# EasyEDA schematic stm32开发板f103.json

## Sheets
1 一些外设: TITLE: 一些外设; REV: 1.0; Date: 2022-10-25; Sheet: 2/7; Drawn By: Uchiha-Leslie; Company: Your Company
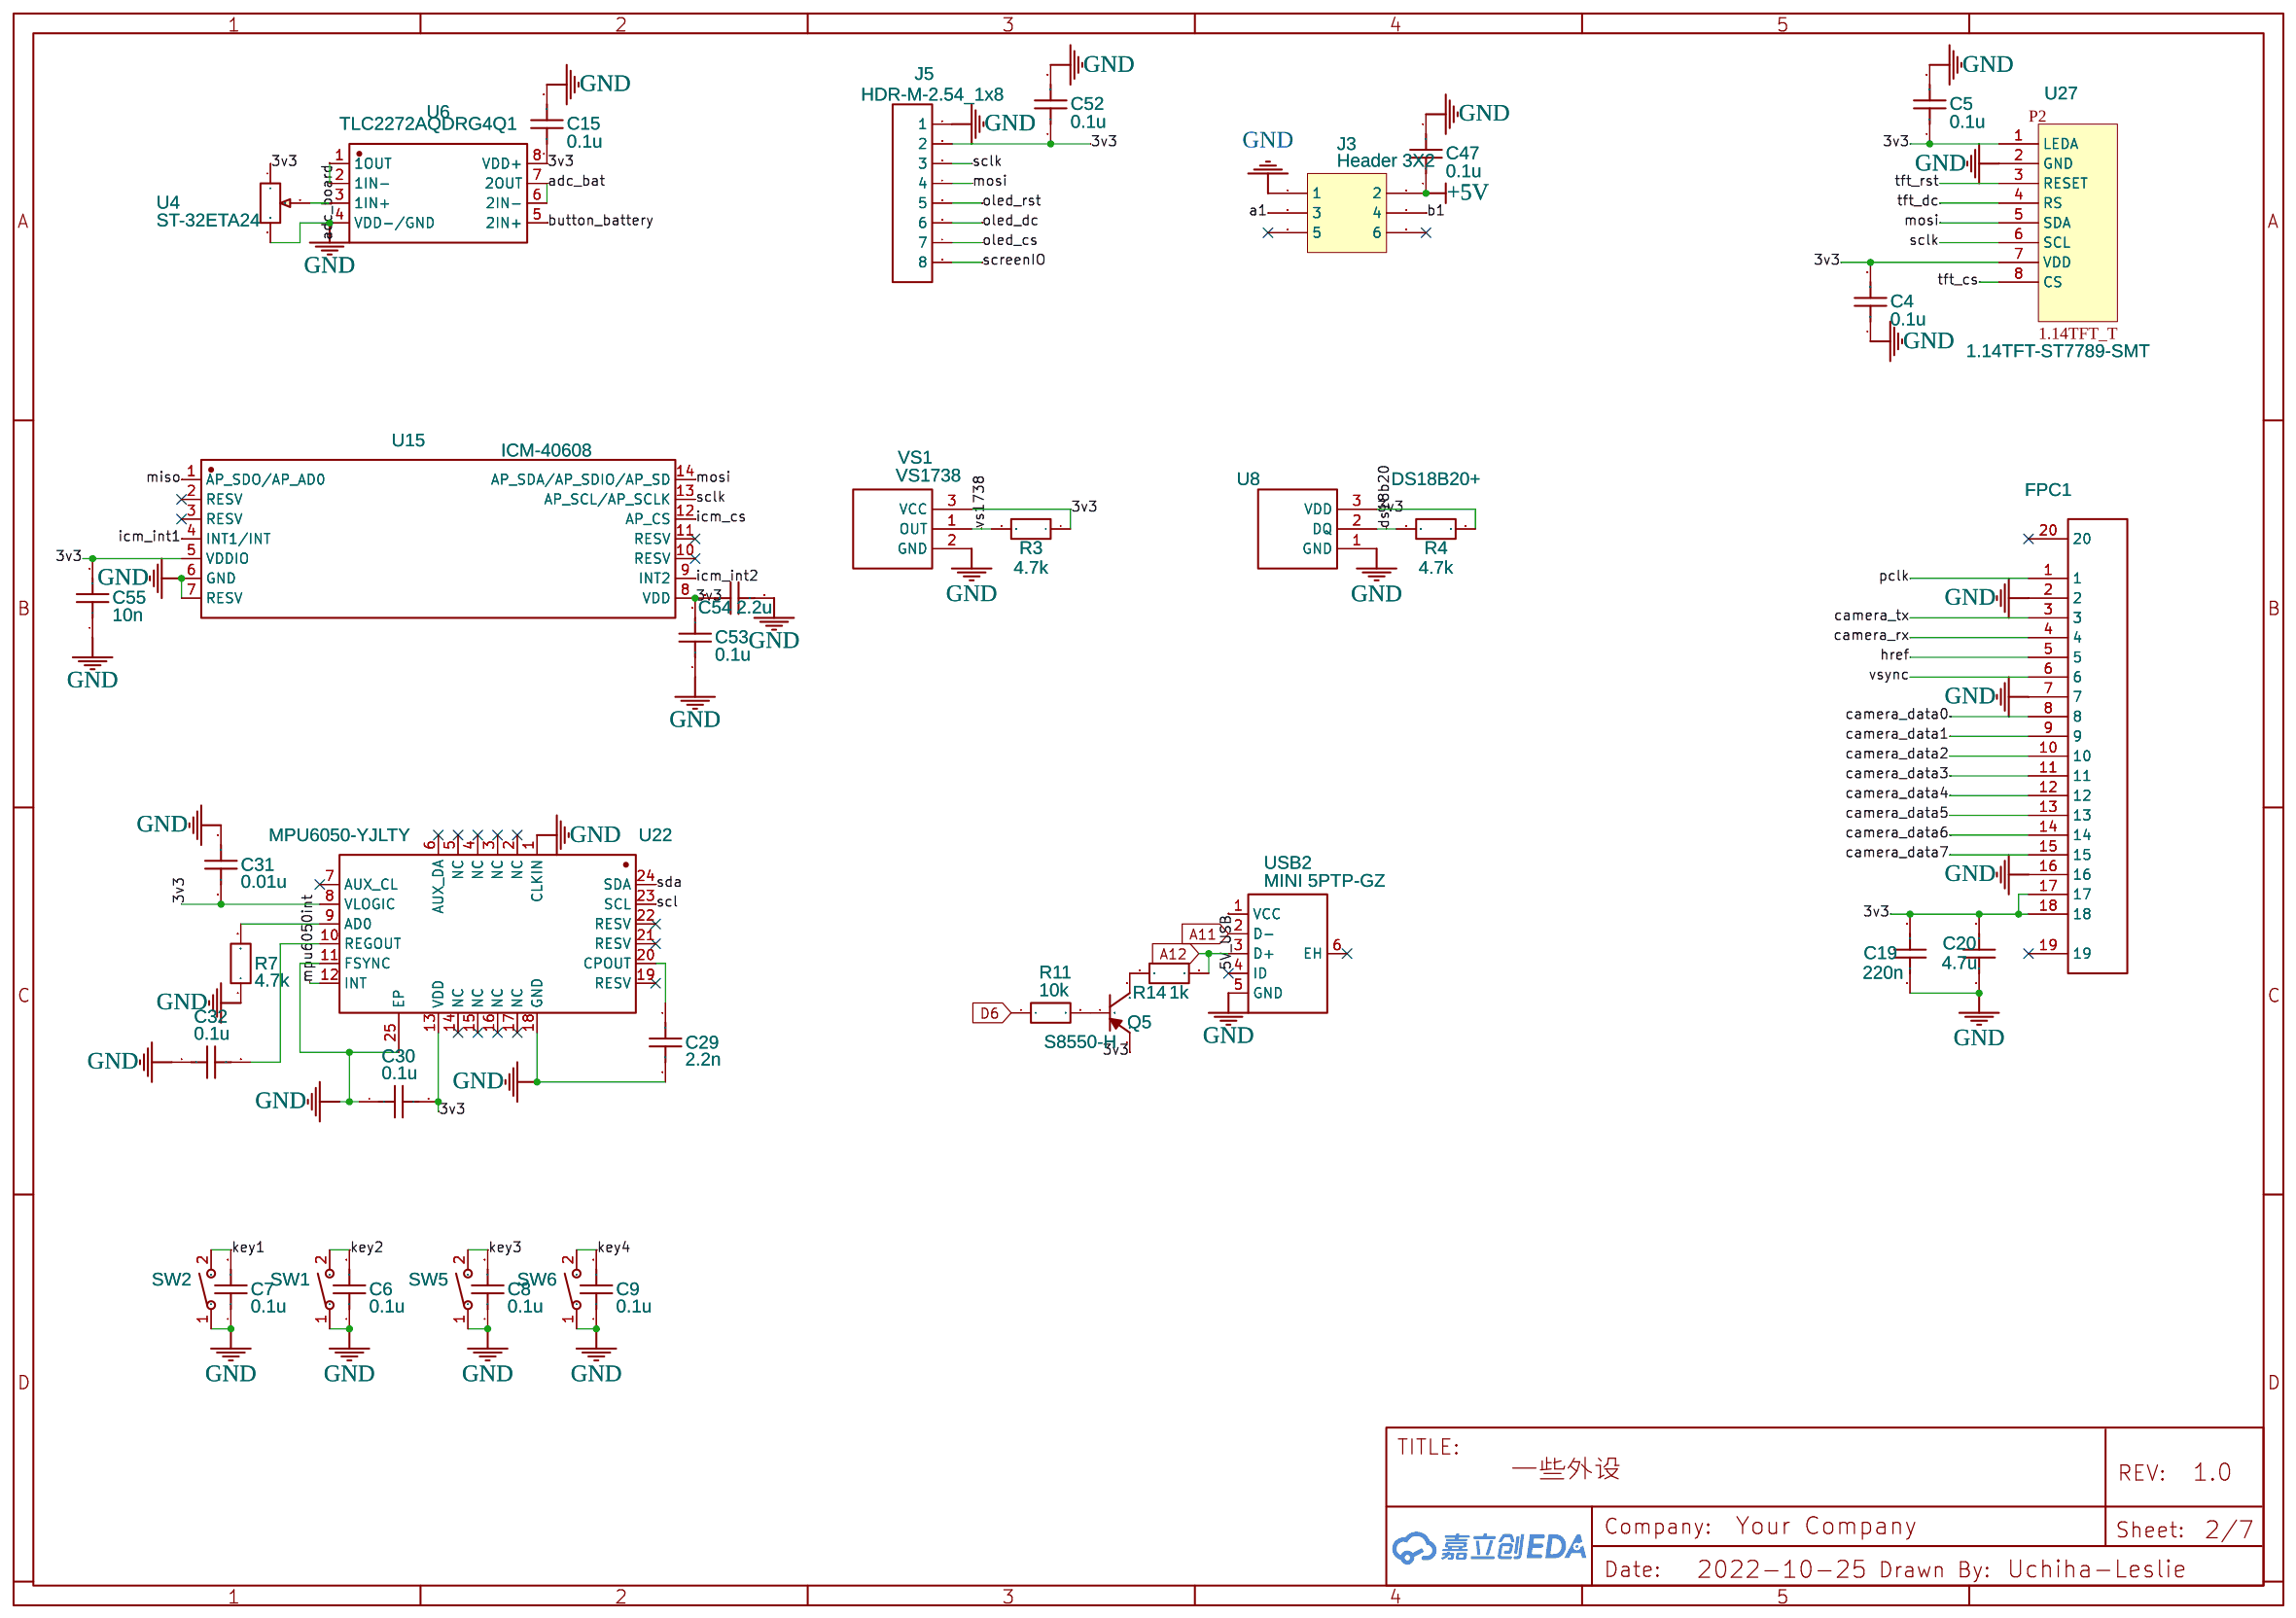
[diagram p0: 一些外设]
2 电源及串口: TITLE: 电源、串口; Date: 2022-10-26; Sheet: 3/7
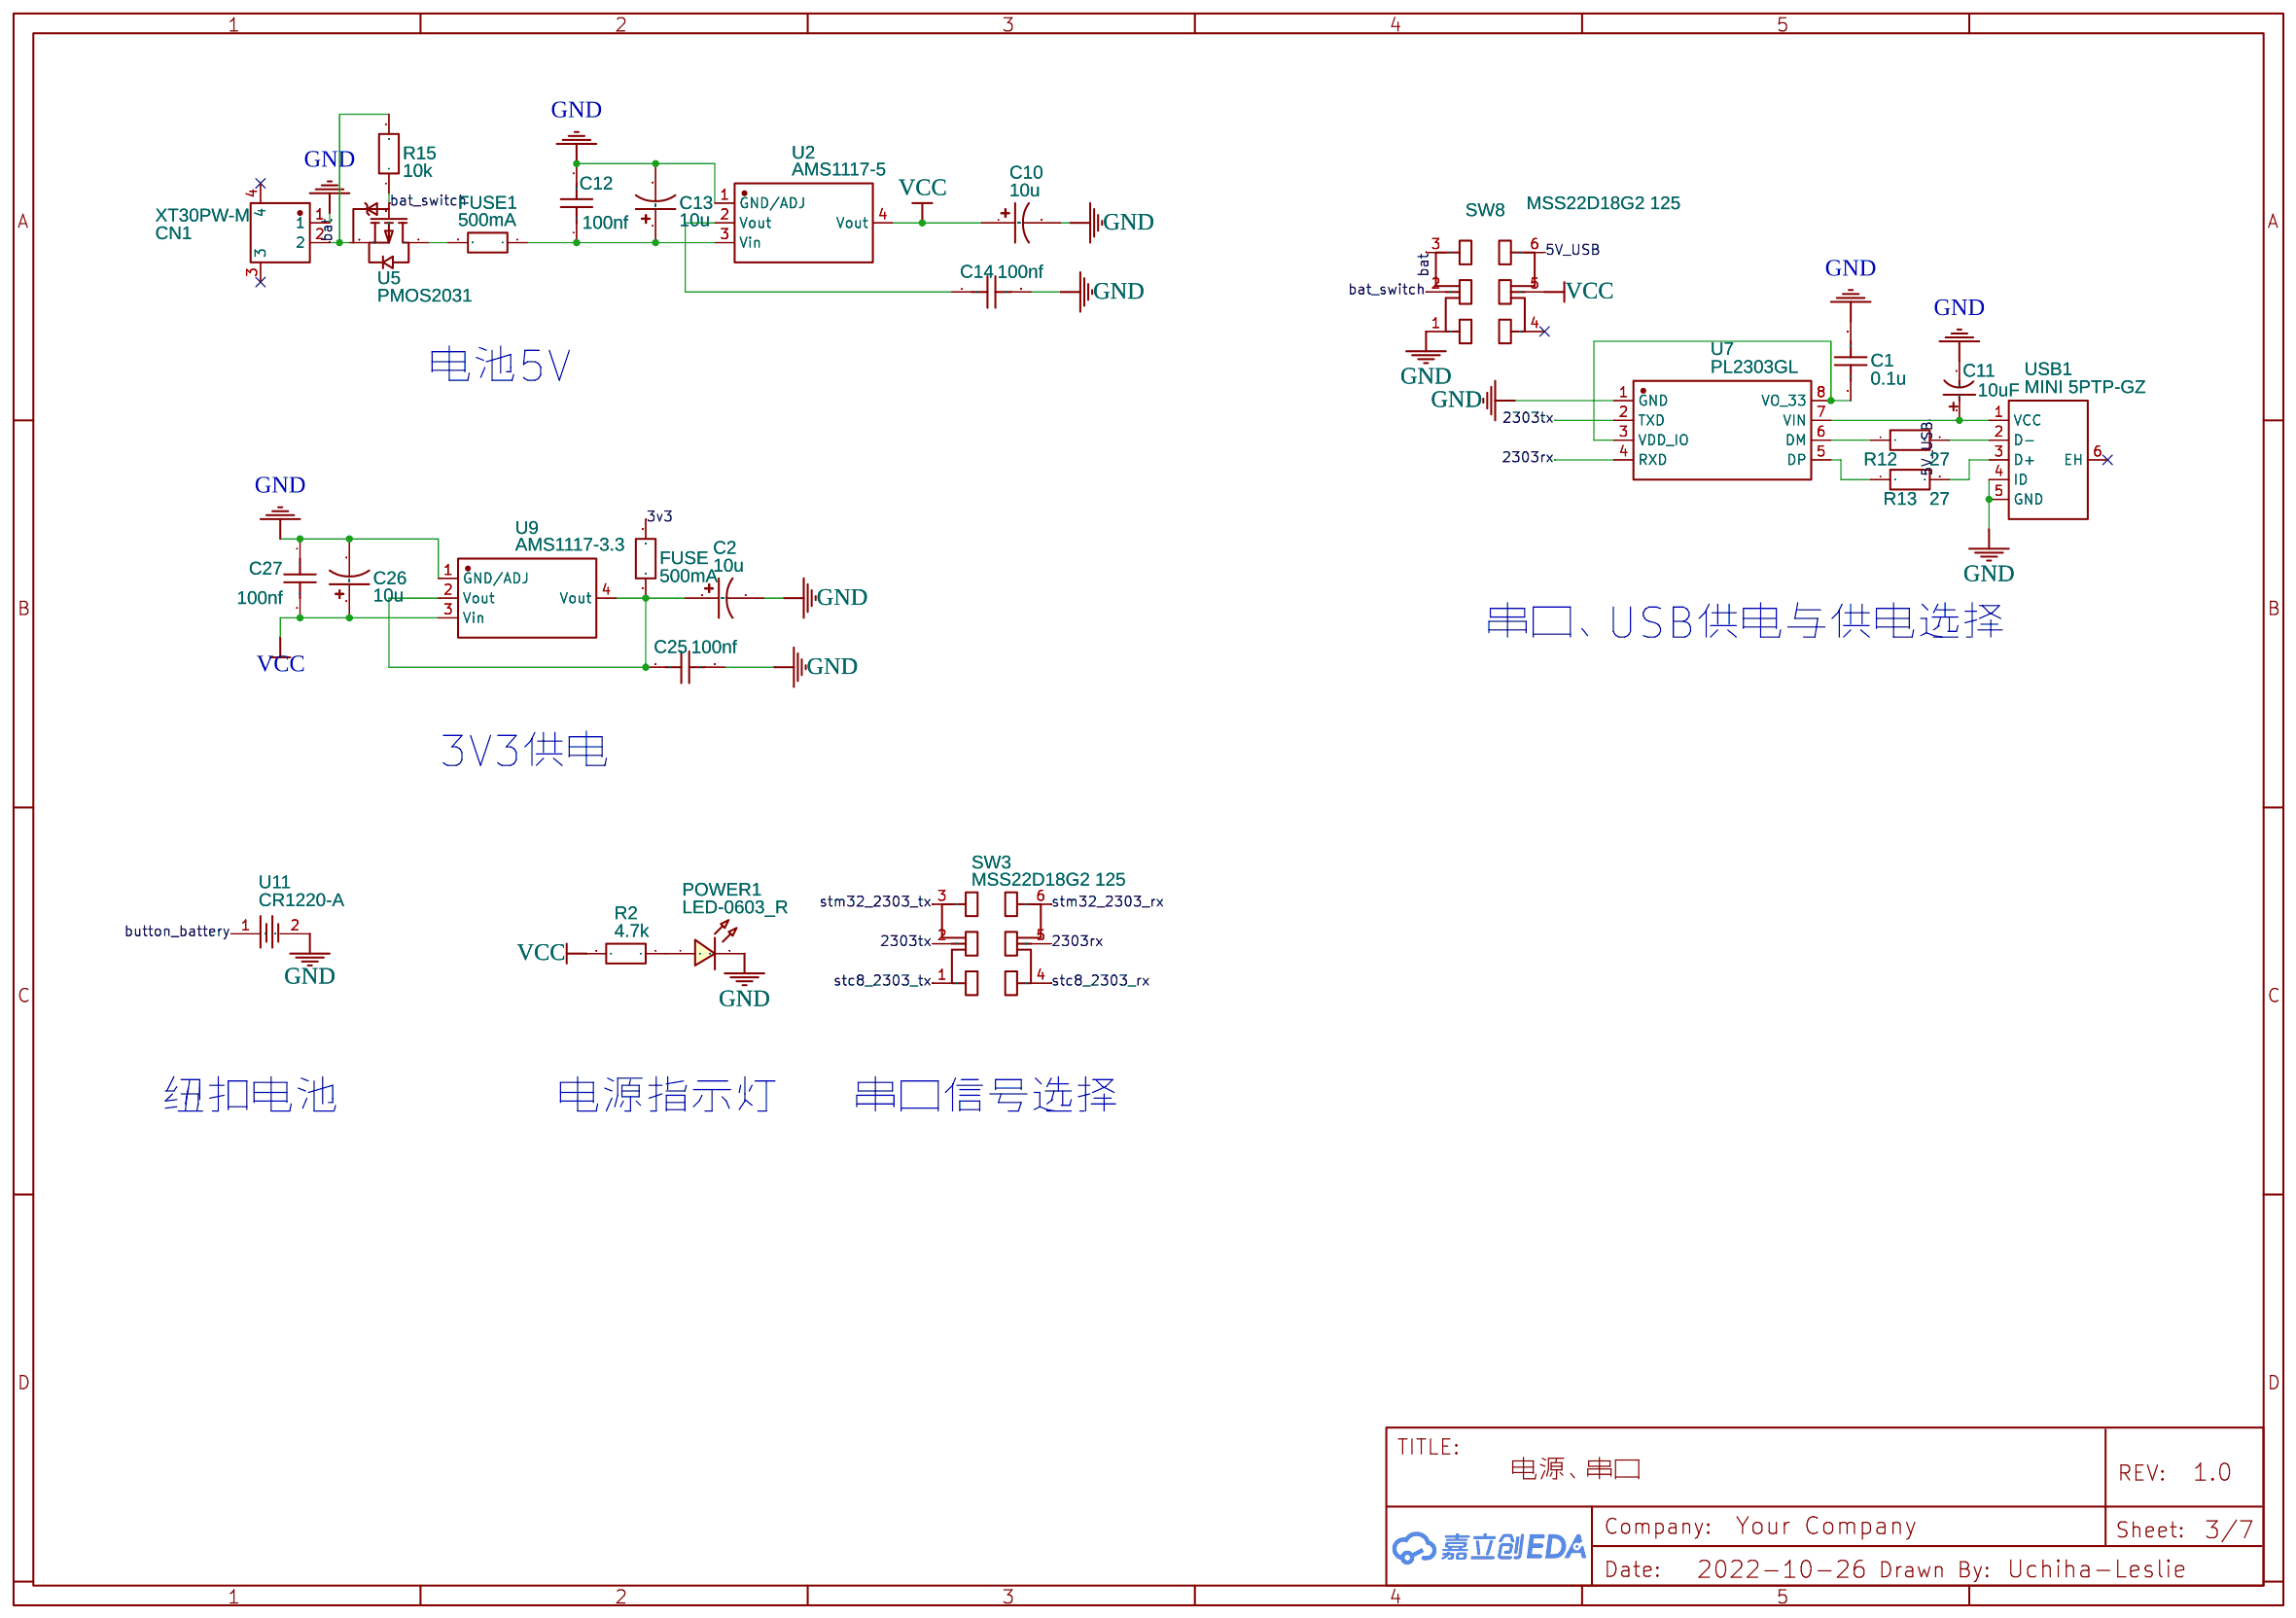
[diagram p1: 电源及串口]
3 MCU: TITLE: STM32F103ZET6; Date: 2022-10-26; Sheet: 1/7
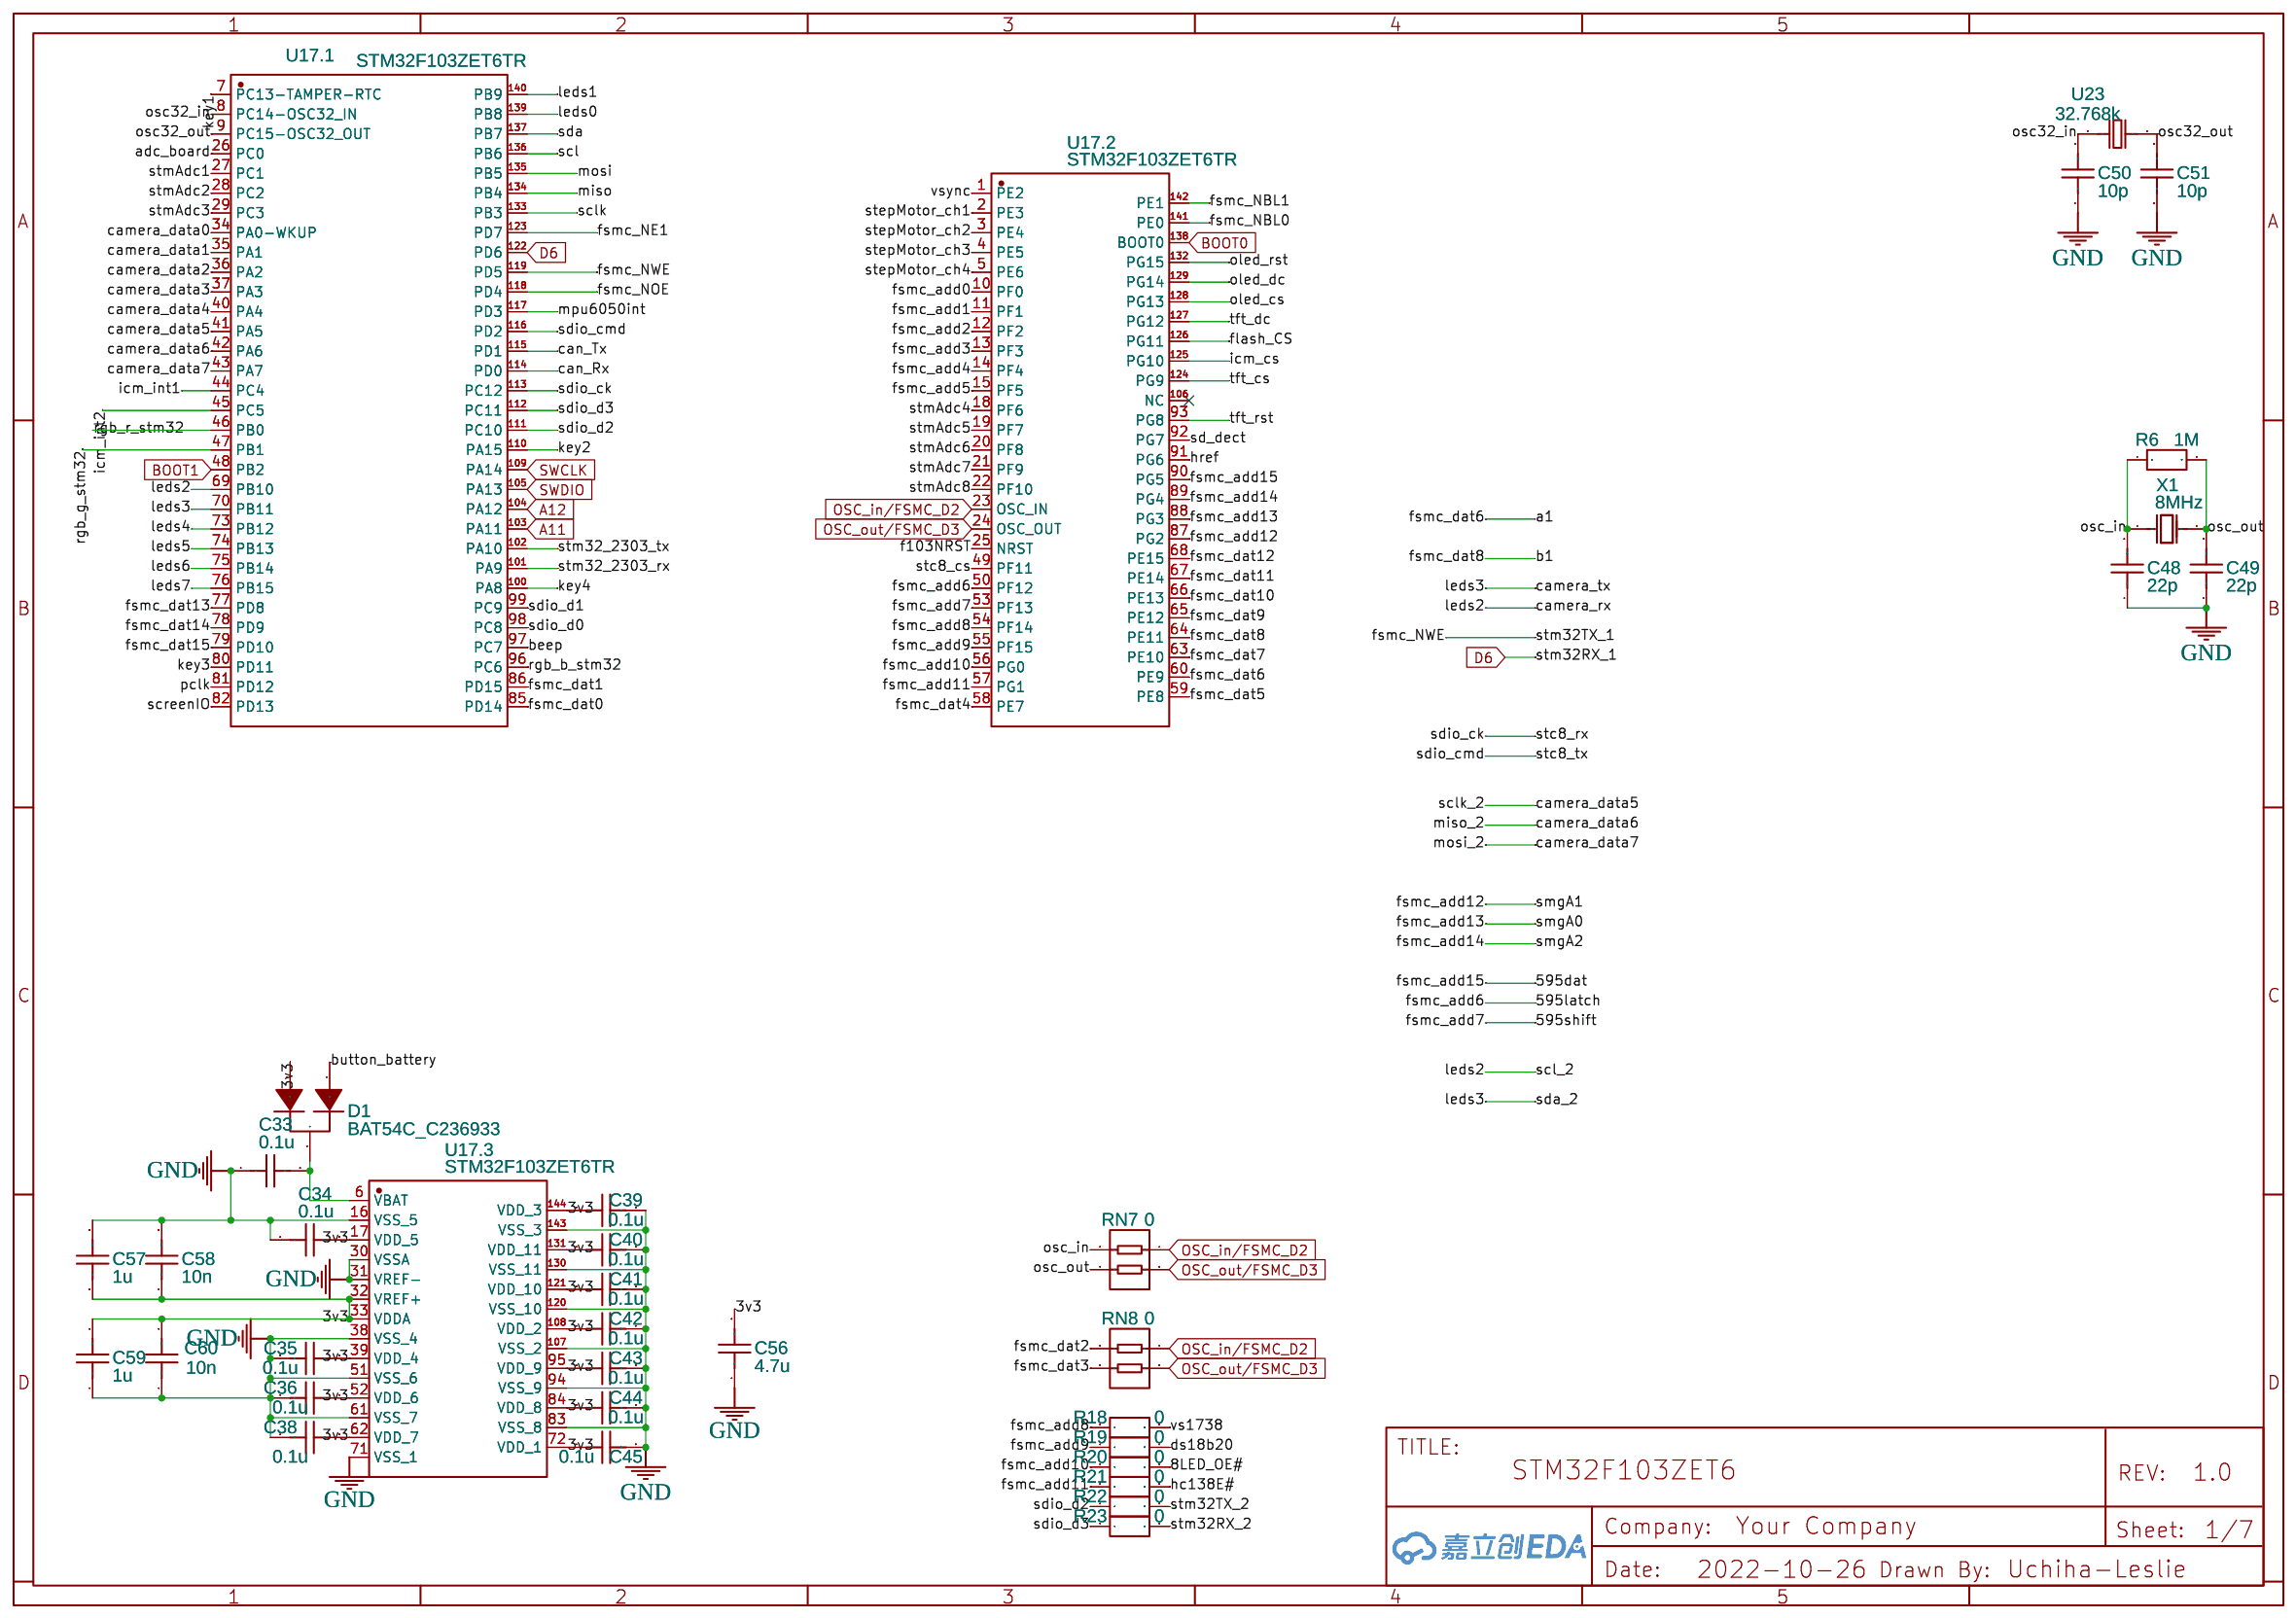
[diagram p2: MCU]
4 stc8: TITLE: stc8; Date: 2022-10-26; Sheet: 5/7
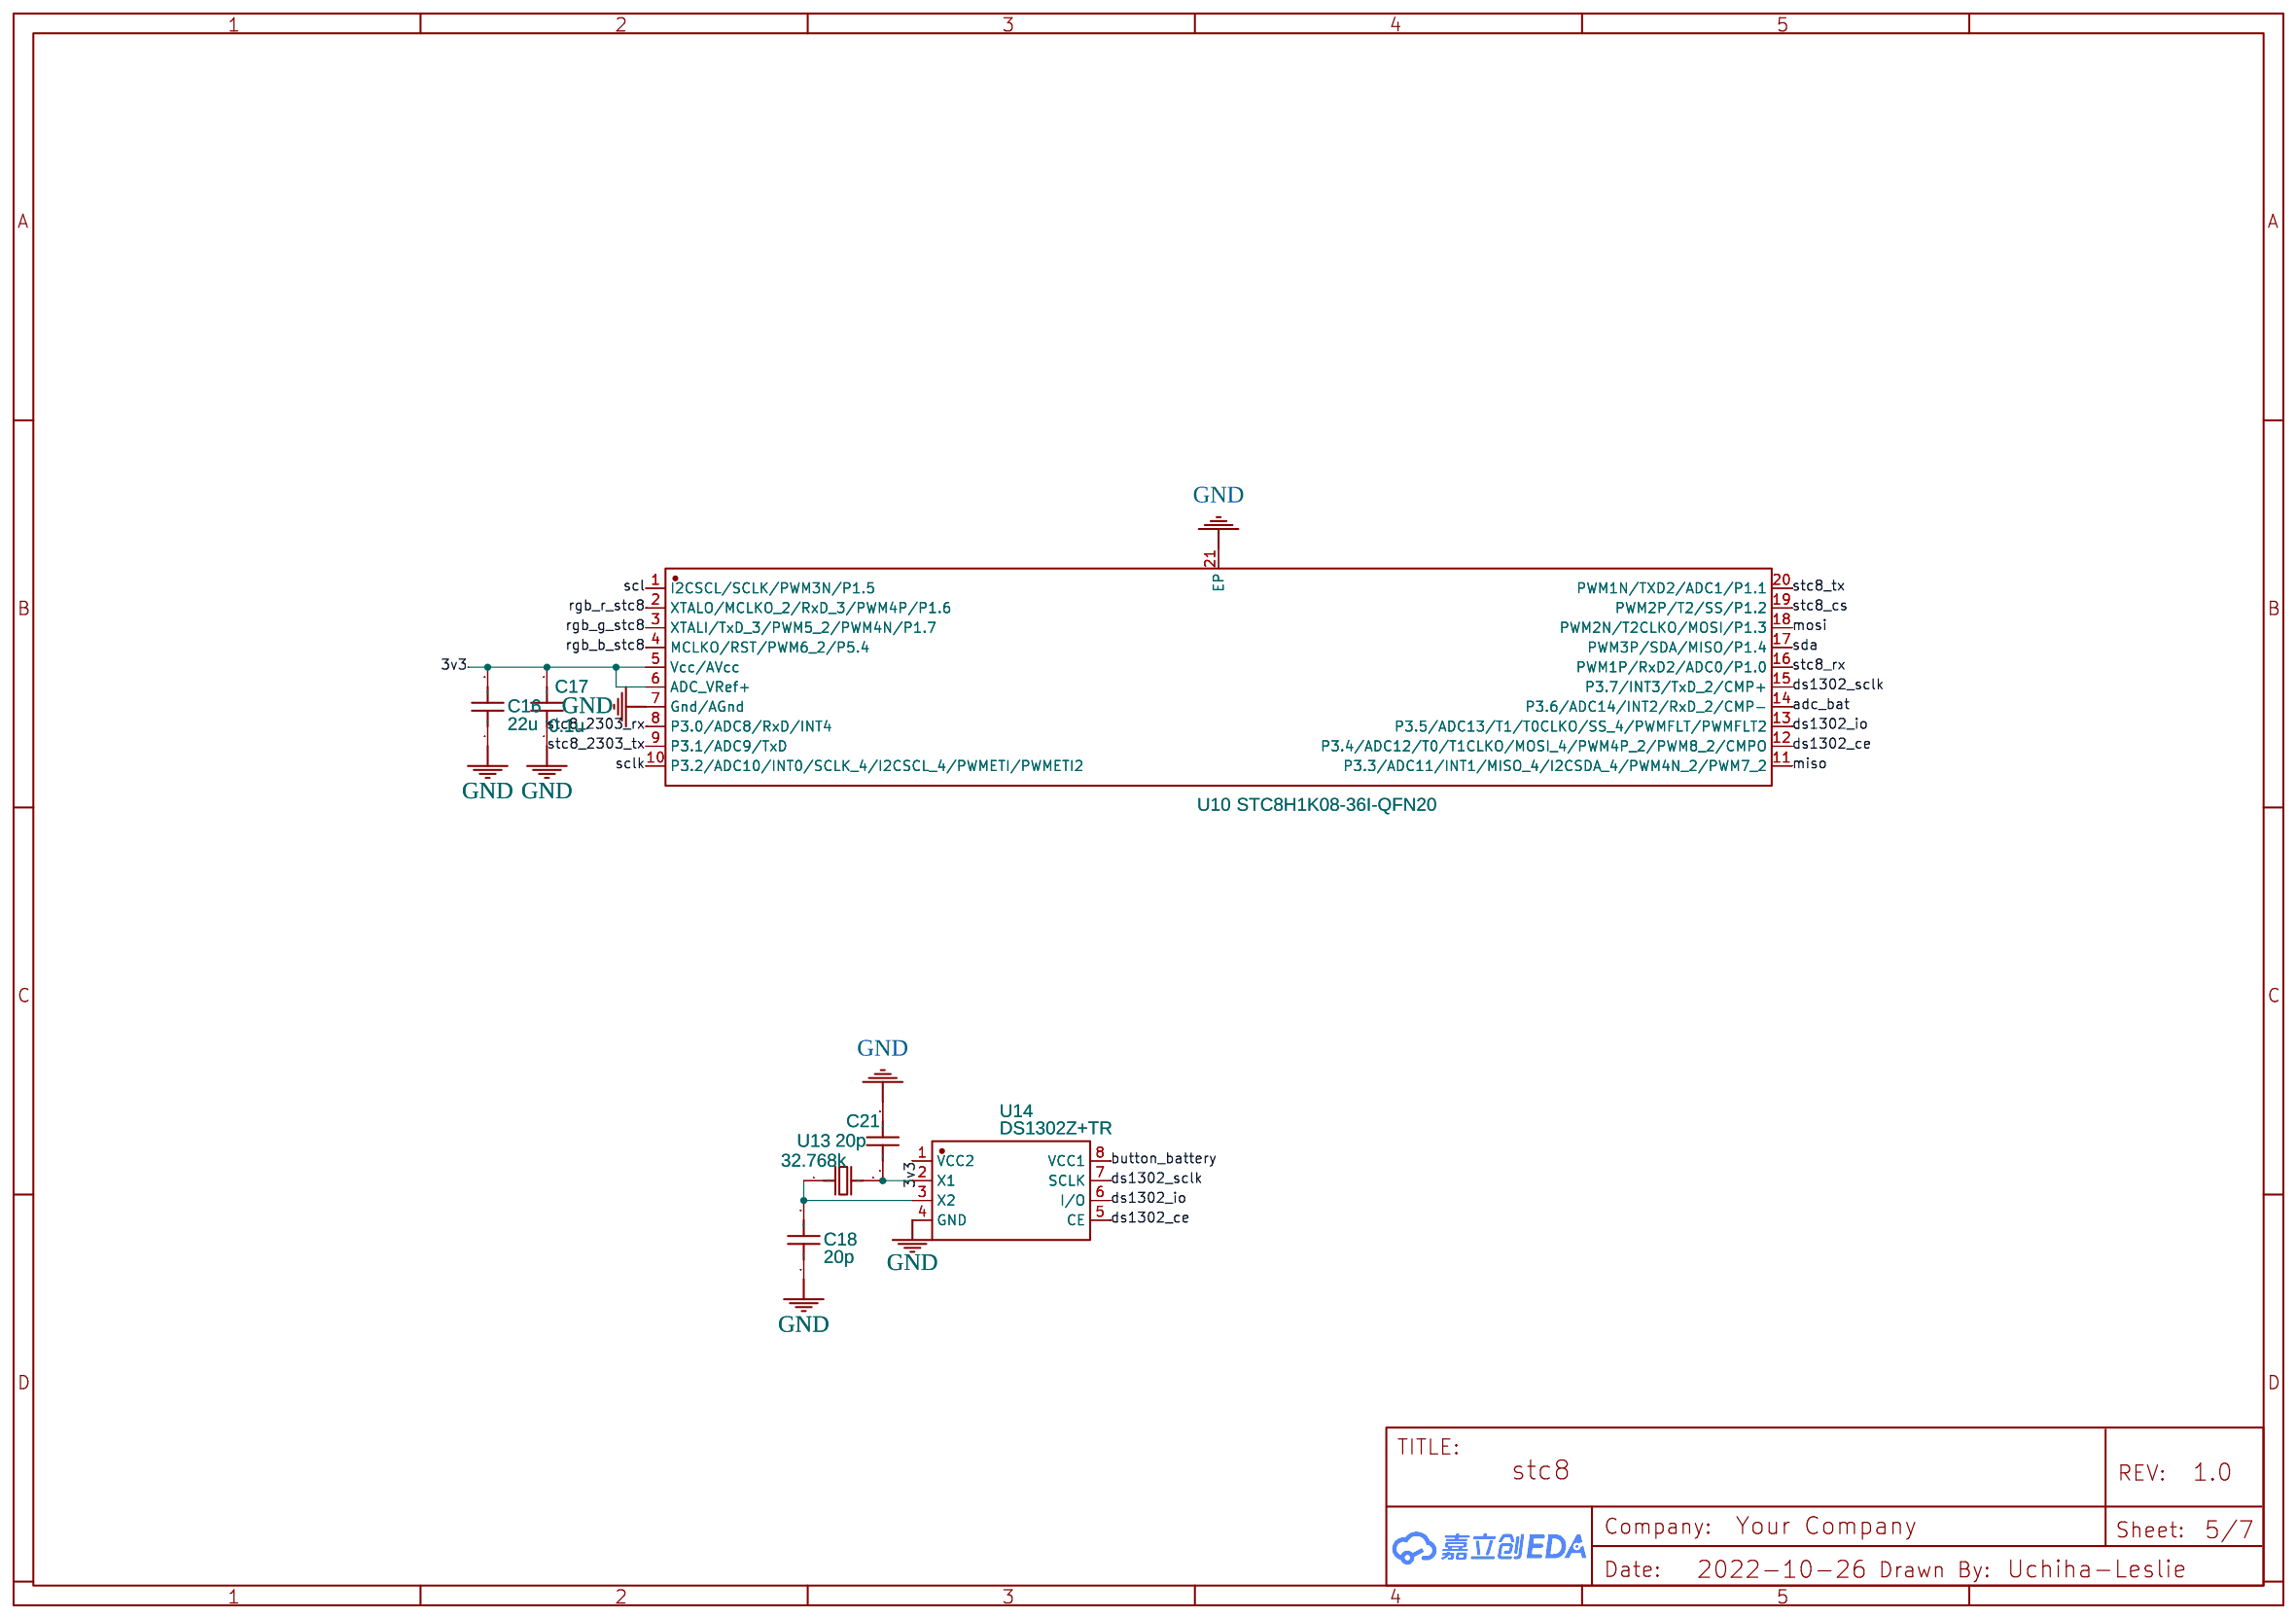
[diagram p3: stc8]
5 光污染和声污染: TITLE: Sheet_2; Date: 2022-10-26; Sheet: 4/7
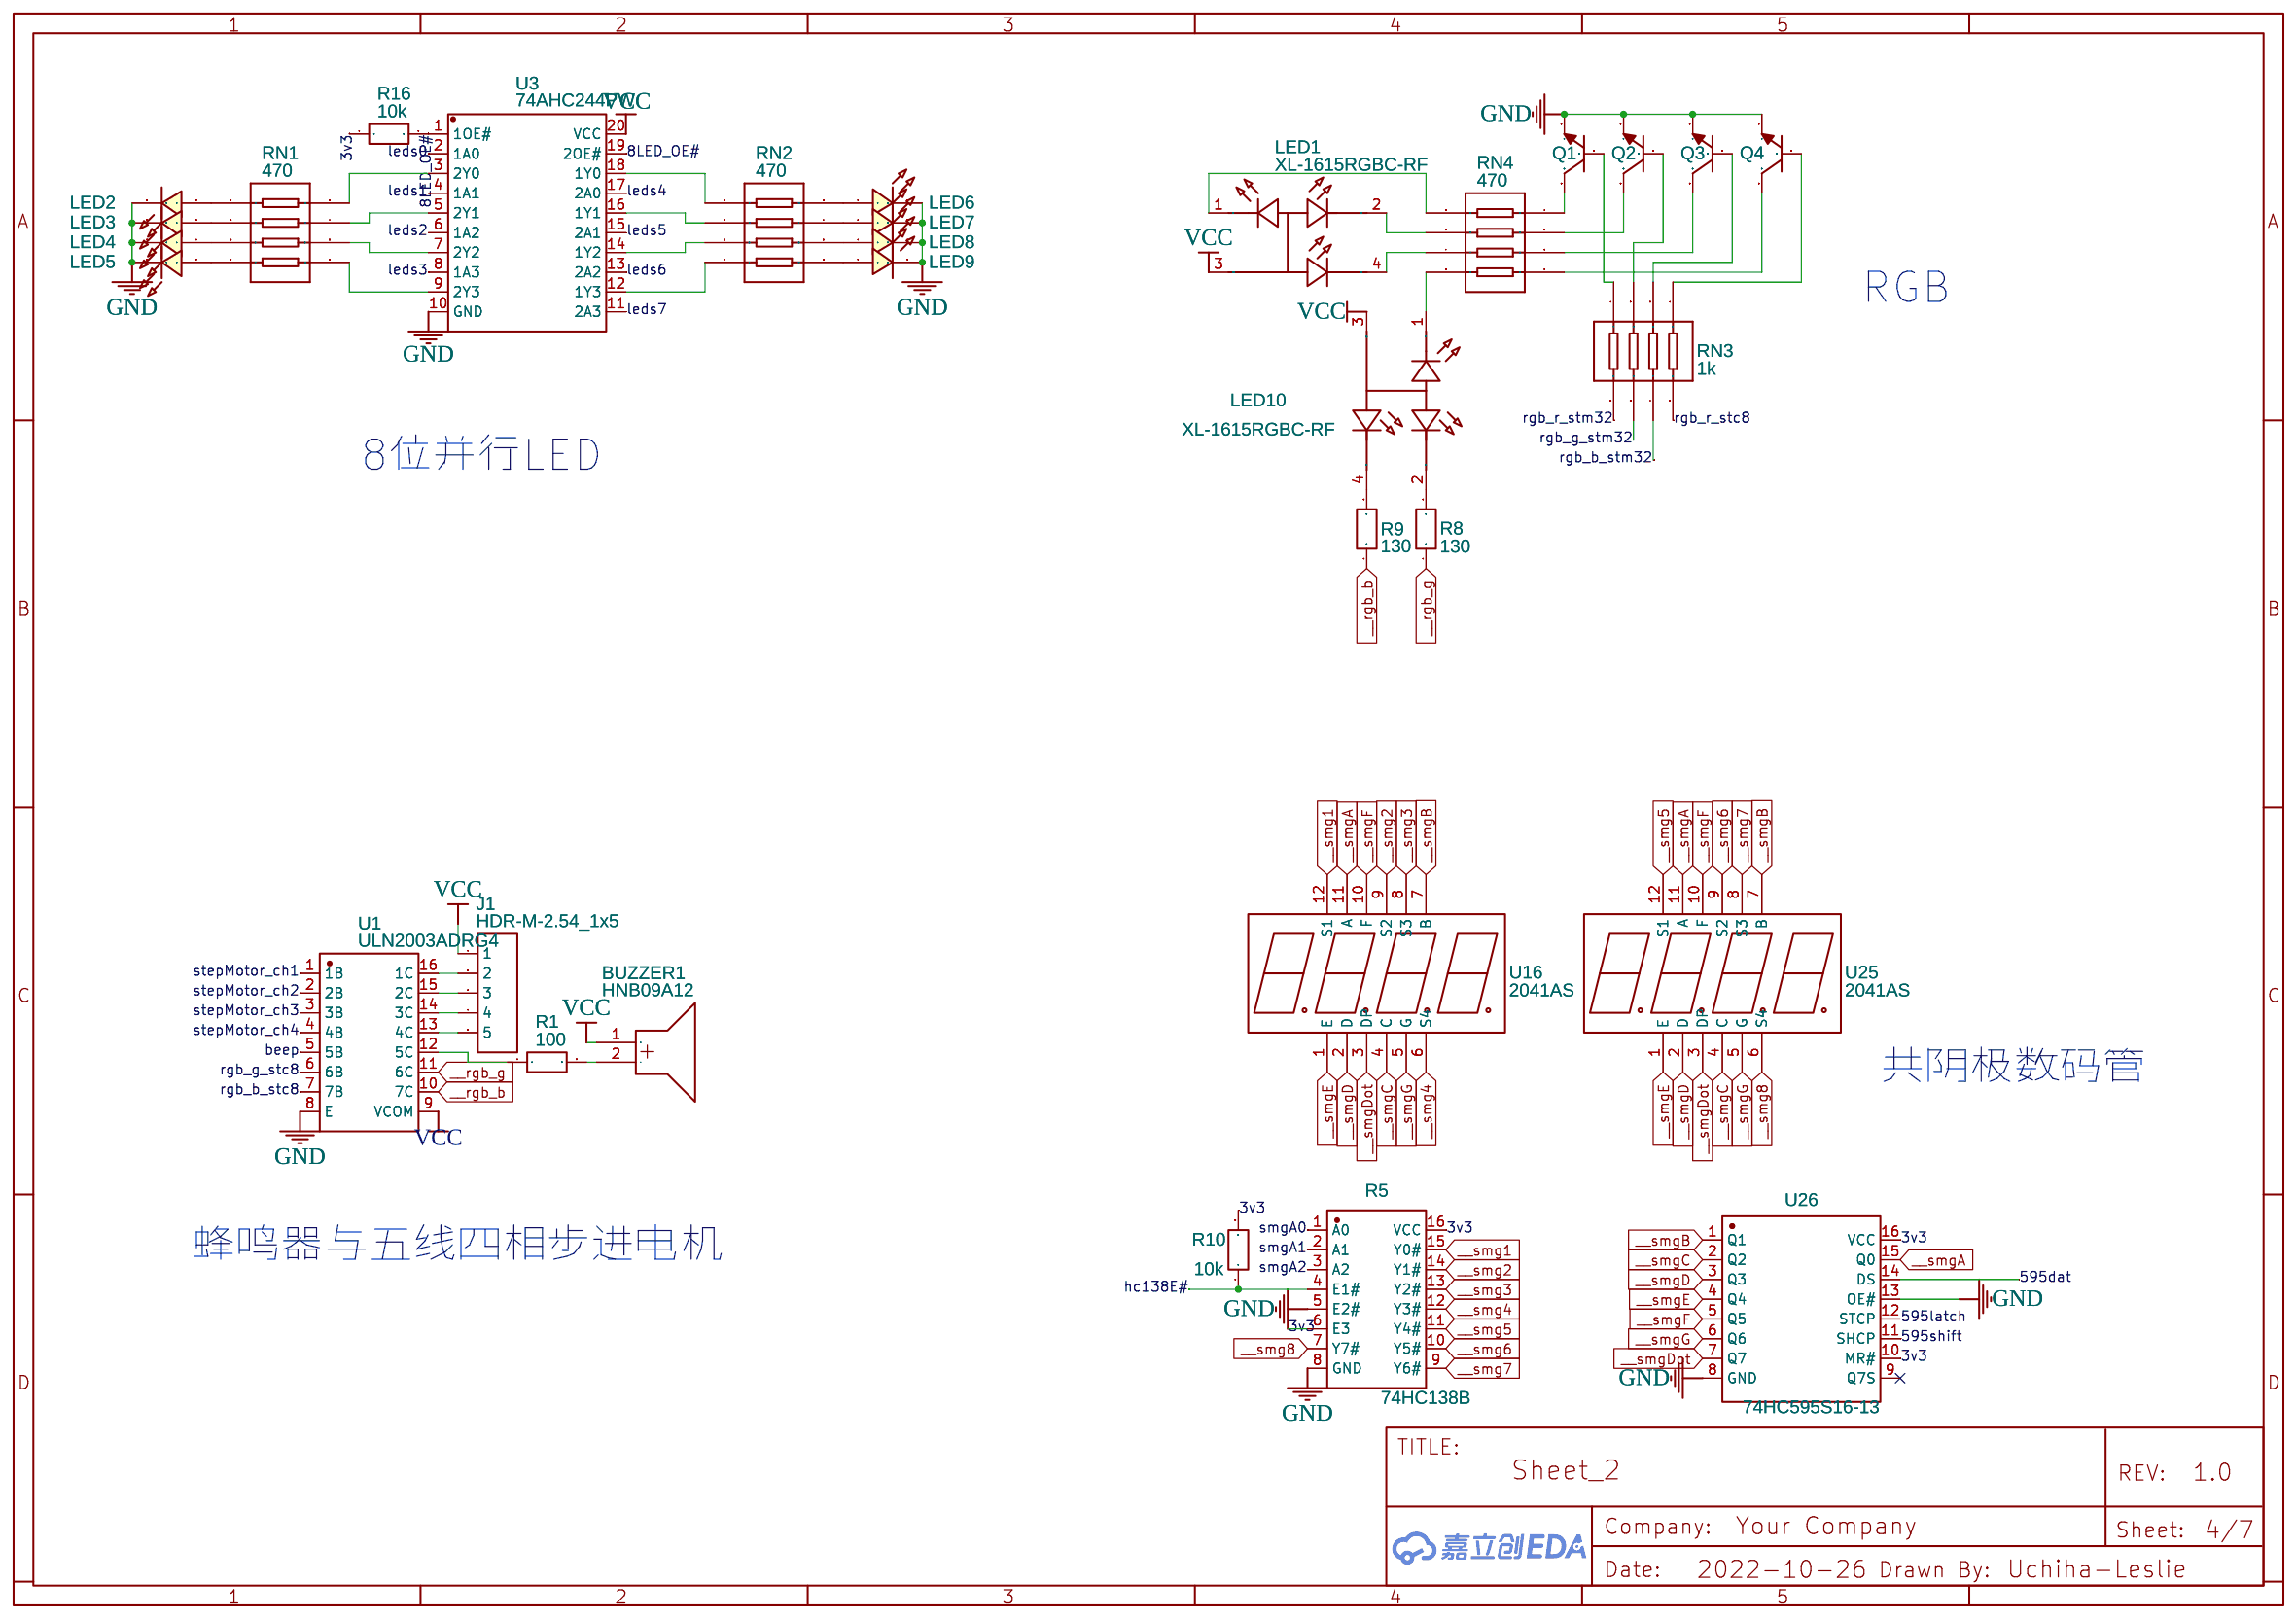
[diagram p4: 光污染和声污染]
6 外部储存: TITLE: 外部储存; Date: 2022-10-27; Sheet: 6/7
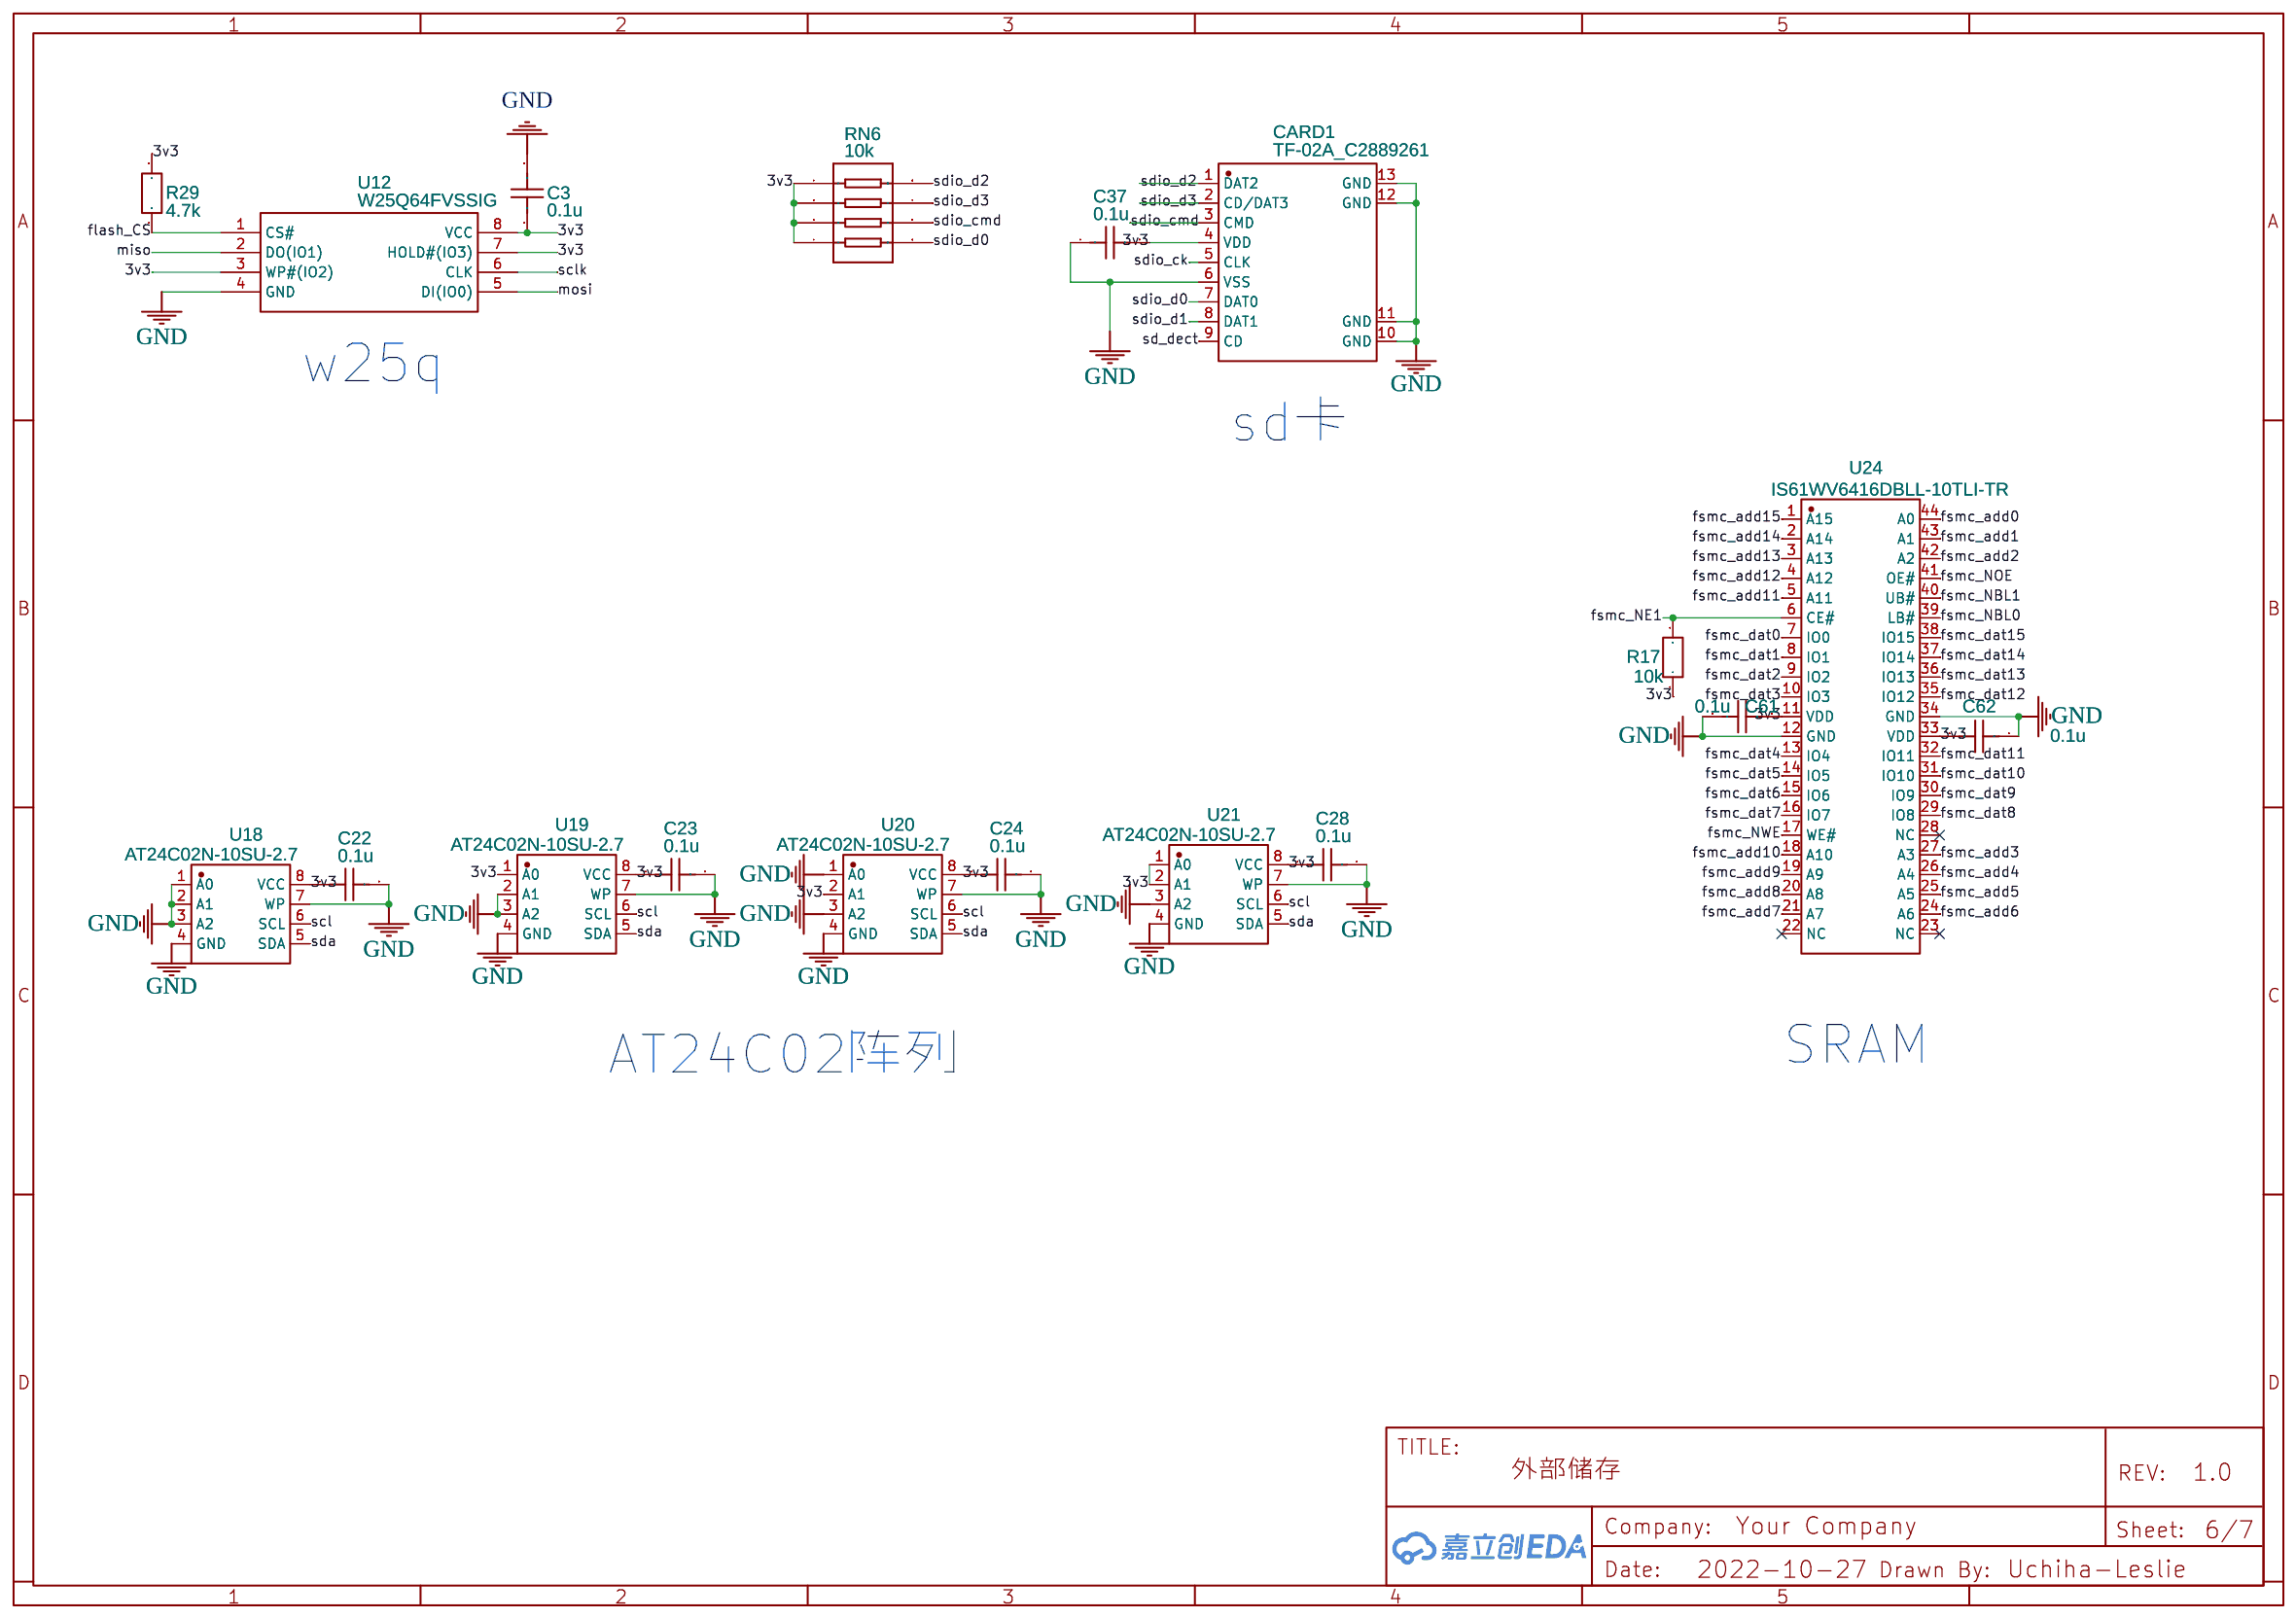
[diagram p5: 外部储存]
7 烧录、启动与外接: TITLE: 烧录、启动与外接; Date: 2022-11-06; Sheet: 7/7
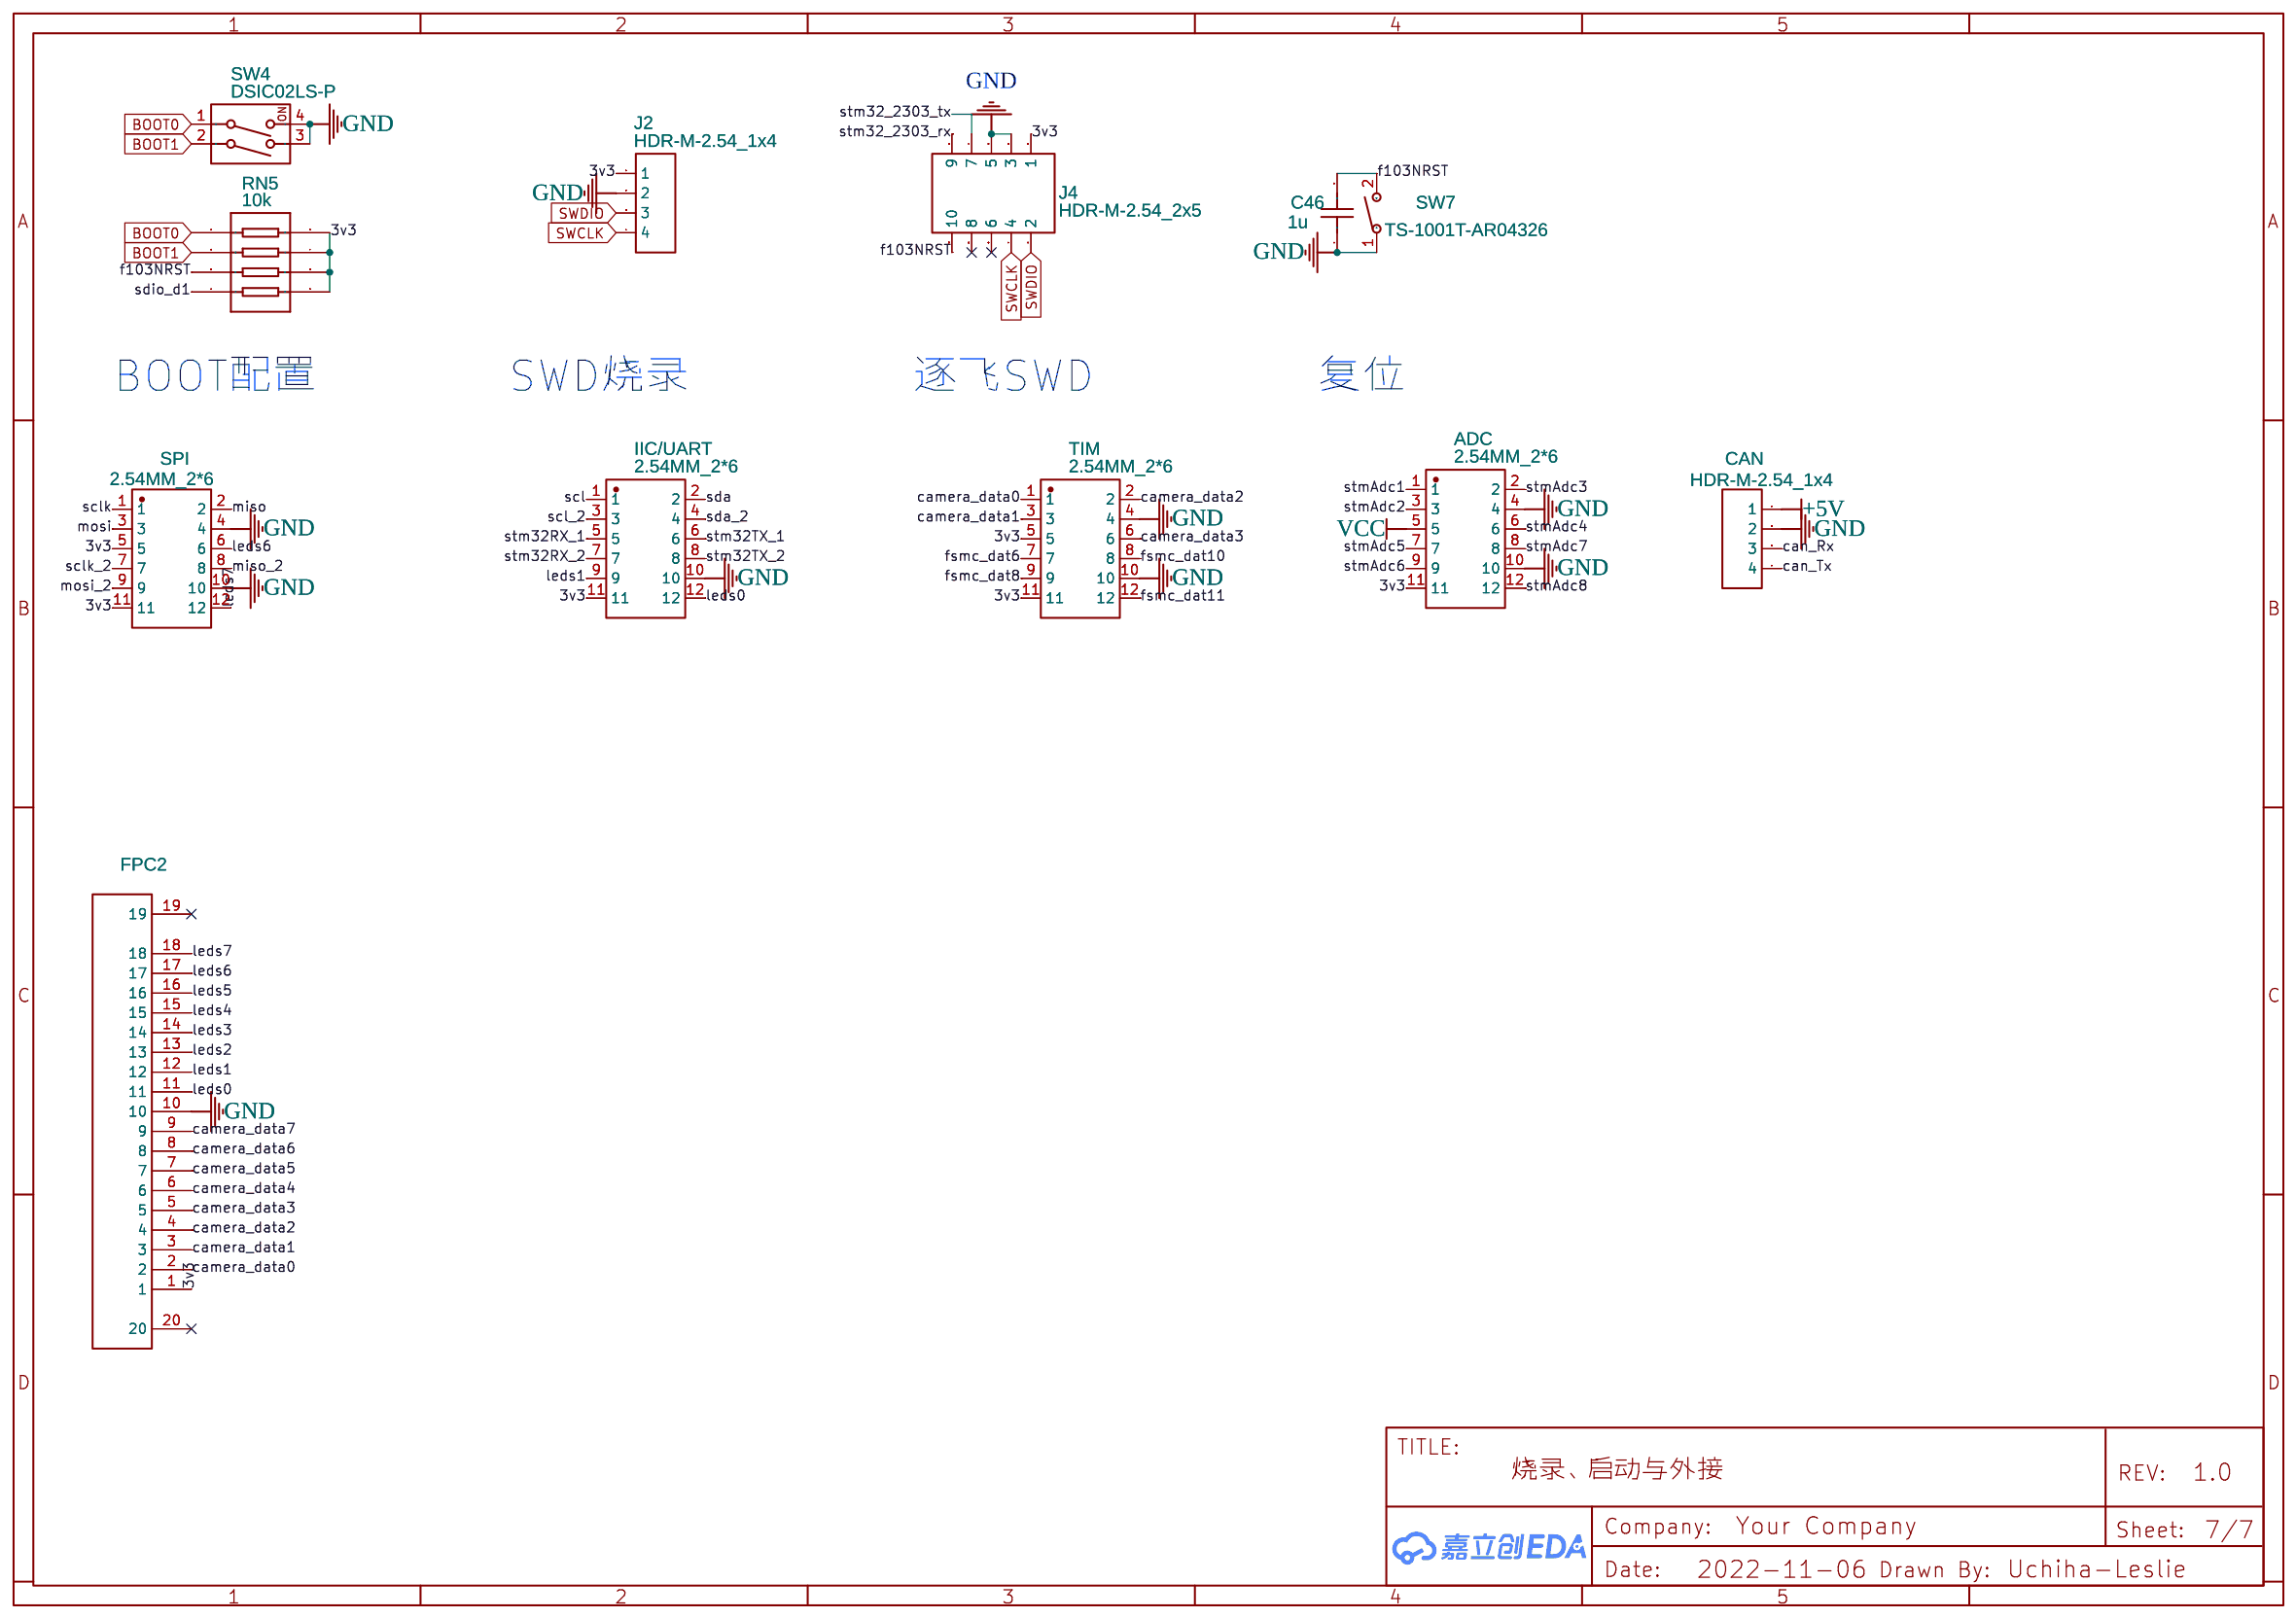
[diagram p6: 烧录、启动与外接]

## Parts
sheet MCU
C33  0.1u  [C0402]
C34  0.1u  [C0402]
C35  0.1u  [C0402]
C36  0.1u  [C0402]
C38  0.1u  [C0402]
C39  0.1u  [C0402]
C40  0.1u  [C0402]
C41  0.1u  [C0402]
C42  0.1u  [C0402]
C43  0.1u  [C0402]
C44  0.1u  [C0402]
C45  0.1u  [C0402]
C48  22p  [C0603]
C49  22p  [C0603]
C50  10p  [C0402]
C51  10p  [C0402]
C56  4.7u  [C0603]
C57  1u  [C0603]
C58  10n  [C0603]
C59  1u  [C0603]
C60  10n  [C0603]
D1  BAT54C_C236933  [SOT-23-3_L3.0-W1.7-P0.95-LS2.9-BR]
R6  1M  [R0603]
R18  0  [R0603]
R19  0  [R0603]
R20  0  [R0603]
R21  0  [R0603]
R22  0  [R0603]
R23  0  [R0603]
RN7  0  [RES-ARRAY-SMD_0402-4P-L1.0-W1.0-BL]
RN8  0  [RES-ARRAY-SMD_0402-4P-L1.0-W1.0-BL]
U17  STM32F103ZET6TR  [LQFP-144_L20.0-W20.0-P0.50-LS22.0-BL]  (sections 1,2,3)
U23  32.768k  [CRYSTAL-SMD_L7.0-W4.1-LS7.6]
X1  8MHz  [HC-49US_L11.0-W4.6-P4.88]
sheet stc8
C16  22u  [C0402]
C17  0.1u  [C0402]
C18  20p  [C0603]
C21  20p  [C0603]
U10  STC8H1K08-36I-QFN20  [QFN-20_L3.0-W3.0-P0.40-BL-EP1.7]
U13  32.768k  [CRYSTAL-SMD_L7.0-W4.1-LS7.6]
U14  DS1302Z+TR  [SO-8_L4.9-W3.9-P1.27-LS5.9-BL]
sheet 一些外设
C4  0.1u  [C0402]
C5  0.1u  [C0402]
C6  0.1u  [C0603]
C7  0.1u  [C0603]
C8  0.1u  [C0603]
C9  0.1u  [C0603]
C15  0.1u  [C0402]
C19  220n  [C0603]
C20  4.7u  [C0603]
C29  2.2n  [C0603]
C30  0.1u  [C0402]
C31  0.01u  [C0603]
C32  0.1u  [C0402]
C47  0.1u  [C0402]
C52  0.1u  [C0402]
C53  0.1u  [C0402]
C54  2.2u  [C0603]
C55  10n  [C0603]
FPC1  F0500WR-S-18PNLNG1GB0R  [FPC-SMD_18P-P0.50_F0500WR-S-18PNLNG1GB0R]
J3  Header 3X2  [编码器]
J5  HDR-M-2.54_1x8  [HDR-M-2.54_1X8]
Q5  S8550-H  [SOT-23-3_L2.9-W1.3-P1.90-LS2.4-BR]
R3  4.7k  [R0603]
R4  4.7k  [R0603]
R7  4.7k  [R0603]
R11  10k  [R0402]
R14  1k  [R0603]
SW1  TS-1001T-AR04326  [KEY-SMD_L6.0-W3.5-LS8.0]
SW2  TS-1001T-AR04326  [KEY-SMD_L6.0-W3.5-LS8.0]
SW5  TS-1001T-AR04326  [KEY-SMD_L6.0-W3.5-LS8.0]
SW6  TS-1001T-AR04326  [KEY-SMD_L6.0-W3.5-LS8.0]
U4  ST-32ETA24  [RES-ADJ-SMD_3P-L3.4-W3.4-P2.10-BR]
U6  TLC2272AQDRG4Q1  [SOIC-8_L4.9-W3.9-P1.27-LS6.0-BL]
U8  DS18B20+  [TO-92-3_L4.9-W3.7-P1.27-L]
U15  ICM-40608  [LGA-14L_L3.0-W2.5-P0.50-TL]
U22  MPU6050-YJLTY  [QFN-24_L4.0-W4.0-P0.50-BL-EP2.7]
U27  1.14TFT-ST7789-SMT  [1.14TFT-ST7789-SMT]
USB2  MINI 5PTP-GZ  [MINI-USB-SMD_MINI-5PTP-GZ]
VS1  VS1738  [VS1738]
sheet 光污染和声污染
BUZZER1  HNB09A12  [BUZ-TH_BD14.1-P7.62-D1.0-FD]
J1  HDR-M-2.54_1x5  [HDR-M-2.54_1X5]
LED1  XL-1615RGBC-RF  [LED-SMD_4P-L1.6-W1.5-TL-A]
LED2  LED-0603_R  [LED0603_RED]
LED3  LED-0603_R  [LED0603_RED]
LED4  LED-0603_R  [LED0603_RED]
LED5  LED-0603_R  [LED0603_RED]
LED6  LED-0603_R  [LED0603_RED]
LED7  LED-0603_R  [LED0603_RED]
LED8  LED-0603_R  [LED0603_RED]
LED9  LED-0603_R  [LED0603_RED]
LED10  XL-1615RGBC-RF  [LED-SMD_4P-L1.6-W1.5-TL-A]
Q1  2N3904(SOT-23)  [SOT-23-3_L2.9-W1.3-P1.90-LS2.4-TR]
Q2  2N3904(SOT-23)  [SOT-23-3_L2.9-W1.3-P1.90-LS2.4-TR]
Q3  2N3904(SOT-23)  [SOT-23-3_L2.9-W1.3-P1.90-LS2.4-TR]
Q4  2N3904(SOT-23)  [SOT-23-3_L2.9-W1.3-P1.90-LS2.4-TR]
R1  100  [R0603]
R5  74HC138B  [SOP-16_L9.9-W3.9-P1.27-LS6.0-BL]
R8  130  [R0603]
R9  130  [R0603]
R10  10k  [R0402]
R16  10k  [R0402]
RN1  470  [RES-ARRAY-SMD_0603-8P-L3.2-W1.6-BL]
RN2  470  [RES-ARRAY-SMD_0603-8P-L3.2-W1.6-BL]
RN3  1k  [RES-ARRAY-SMD_0603-8P-L3.2-W1.6-BL]
RN4  470  [RES-ARRAY-SMD_0603-8P-L3.2-W1.6-BL]
U1  ULN2003ADRG4  [SOP-16_L9.9-W3.9-P1.27-LS6.0-BL]
U3  74AHC244PW  [TSSOP-20_L6.5-W4.4-P0.65-LS6.4-BL]
U16  2041AS  [2401AS]
U25  2041AS  [2401AS]
U26  74HC595S16-13  [SOIC-16_L10.8-W4.5-P1.27-LS6.8-BL]
sheet 外部储存
C3  0.1u  [C0402]
C22  0.1u  [C0402]
C23  0.1u  [C0402]
C24  0.1u  [C0402]
C28  0.1u  [C0402]
C37  0.1u  [C0603]
C61  0.1u  [C0402]
C62  0.1u  [C0402]
CARD1  TF-02A_C2889261  [TF-SMD_TF-02]
R17  10k  [R0402]
R29  4.7k  [R0603]
RN6  10k  [RES-ARRAY-SMD_0603-8P-L3.2-W1.6-BL]
U12  W25Q64FVSSIG  [SOP-8_L5.3-W5.2-P1.27-LS7.9-BL]
U18  AT24C02N-10SU-2.7  [SOIC-8_L4.9-W3.9-P1.27-LS6.0-BL]
U19  AT24C02N-10SU-2.7  [SOIC-8_L4.9-W3.9-P1.27-LS6.0-BL]
U20  AT24C02N-10SU-2.7  [SOIC-8_L4.9-W3.9-P1.27-LS6.0-BL]
U21  AT24C02N-10SU-2.7  [SOIC-8_L4.9-W3.9-P1.27-LS6.0-BL]
U24  IS61WV6416DBLL-10TLI-TR  [TSOPII-44_L18.4-W10.2-P0.80-LS11.76-BL]
sheet 烧录、启动与外接
ADC  2.54MM_2*6  [HDR-SMD_12P-P2.54-V-F-R2-C6-S7.0]
C46  1u  [C0603]
CAN  HDR-M-2.54_1x4  [HDR-M-2.54_1X4]
FPC2  F0500WR-S-18PNLNG1GB0R  [FPC-SMD_18P-P0.50_F0500WR-S-18PNLNG1GB0R]
IIC/UART  2.54MM_2*6  [HDR-SMD_12P-P2.54-V-F-R2-C6-S7.0]
J2  HDR-M-2.54_1x4  [HDR-M-2.54_1X4]
J4  HDR-M-2.54_2x5  [HDR-M-2.54_2X5]
RN5  10k  [RES-ARRAY-SMD_0603-8P-L3.2-W1.6-BL]
SPI  2.54MM_2*6  [HDR-SMD_12P-P2.54-V-F-R2-C6-S7.0]
SW4  DSIC02LS-P  [SW-SMD_4P-L6.0-W6.2-P2.54-LS9.8]
SW7  TS-1001T-AR04326  [KEY-SMD_L6.0-W3.5-LS8.0]
TIM  2.54MM_2*6  [HDR-SMD_12P-P2.54-V-F-R2-C6-S7.0]
sheet 电源及串口
C1  0.1u  [C0402]
C2  10u  [CASE-A_3216]
C10  10u  [CASE-A_3216]
C11  10uF  [CAP-TH_BD4.0-P1.50-D0.8-FD]
C12  100nf  [C0603]
C13  10u  [CASE-A_3216]
C14  100nf  [C0603]
C25  100nf  [C0603]
C26  10u  [CASE-A_3216]
C27  100nf  [C0603]
CN1  XT30PW-M  [CONN-TH_XT30PW-M]
FUSE  500mA  [R0603]
FUSE1  500mA  [R0603]
POWER1  LED-0603_R  [LED0603_RED]
R2  4.7k  [R0603]
R12  27  [R0603]
R13  27  [R0603]
R15  10k  [R0402]
SW3  MSS22D18G2 125  [SW-TH_SHOU_MSS22D18G2]
SW8  MSS22D18G2 125  [SW-TH_SHOU_MSS22D18G2]
U2  AMS1117-5  [SOT-223-3_L6.5-W3.4-P2.30-LS7.0-BR]
U5  PMOS2031  [SOT-23-3_L2.9-W1.3-P0.95-LS2.4-BR]
U7  PL2303GL  [SOP-8_L4.9-W3.9-P1.27-LS6.0-BL]
U9  AMS1117-3.3  [SOT-223-3_L6.5-W3.4-P2.30-LS7.0-BR]
U11  CR1220-A  [BAT-SMD_CR1220-2]
USB1  MINI 5PTP-GZ  [MINI-USB-SMD_MINI-5PTP-GZ]

## Library data of the parts
C1 C3-C5 C15-C17 C22-C24 C28 C30 C32-C36 C38-C45 C47 C50-C53 C61 C62 = C_0402_US: Contributor: LCEDA_Lib
C6-C9 C12 C14 C18-C21 C25 C27 C29 C31 C37 C46 C48 C49 C54-C60 = C_0603_US: Contributor: LCEDA_Lib
D1 = BAT54C_C236933: Supplier: LCSC; Supplier Part: C236933; Manufacturer: ON Semicon; Manufacturer Part: BAT54C; Contributor: LCSC
FUSE FUSE1 R1-R4 R6-R9 R12-R14 R18-R23 R29 = R_0603_EU: Contributor: LCEDA_Lib
RN7 RN8 = 2D02WGJ0330TCE: Supplier: LCSC; Supplier Part: C425335; Manufacturer: UNI-ROYAL(厚声); Resistance (Ohms): 33; Contributor: LCSC; JLCPCB Part Class: Extended Part
U17 = STM32F103ZET6TR: tags: STM32; Supplier Part: C14508; Supplier: LCSC; Manufacturer: ST(意法半导体); subpart_no: 1; image: http://image.lceda.cn/szlcsc/C14508.jpg; JLCPCB Part Class: Extended Part
U13 U23 = M49SSMD: Supplier: LCSC; Supplier Part: C9900000628; Manufacturer: null; Contributor: LCSC; JLCPCB Part Class: Extended Part
X1 = A-3.579545-30-SL-TR: Supplier: LCSC; Supplier Part: C2191; Manufacturer: Raltron; Contributor: LCSC; JLCPCB Part Class: Extended Part
U10 = STC8H1K08-36I-QFN20: Supplier: LCSC; Supplier Part: C915674; Manufacturer: STC Micro; Contributor: LCSC; JLCPCB Part Class: Extended Part
U14 = DS1302Z+TR: Supplier: LCSC; Supplier Part: C286505; Manufacturer: Maxim Integrated; Contributor: LCSC
FPC1 FPC2 = F0500WR-S-18PNLNG1GB0R: Supplier: LCSC; Supplier Part: C247896; Manufacturer: Joint Tech Elec; Contributor: LCSC; JLCPCB Part Class: Extended Part
J3 = Header 3X2: LatestRevisionDate: 17-Jul-2002; LatestRevisionNote: Re-released for DXP Platform.; Publisher: Altium Limited; Contributor: jhn11996
J5 = HDR-M-2.54_1x8: Supplier Part: C190820; Supplier: LCSC; Contributor: LCEDA_Lib
Q5 = S8550-H: Supplier: LCSC; Supplier Part: C699225; Manufacturer: YANGJIE(扬杰); Contributor: LCSC; JLCPCB Part Class: Extended Part
R10 R11 R15-R17 = R_0402_EU: Contributor: LCEDA_Lib
SW1 SW2 SW5-SW7 = TS-1001T-AR04326: Supplier: LCSC; Supplier Part: C920203; Manufacturer: XUNPU(讯普); Contributor: LCSC; JLCPCB Part Class: Extended Part
U4 = ST-32ETA24: Supplier: LCSC; Supplier Part: C3010425; Manufacturer: NIDEC(尼得科); link: https://atta.szlcsc.com/upload/public/pdf/source/20220330/19FD56B897FE2E9AC4D9DF3A85295F2E.pdf; Contributor: lcsc
U6 = TLC2272AQDRG4Q1: Supplier: LCSC; Supplier Part: C1848169; Manufacturer: TI(德州仪器); link: https://atta.szlcsc.comnull; Contributor: LCSC
U8 = DS18B20+: Supplier: LCSC; Manufacturer: MAXIM; Supplier Part: C9753; JLCPCB Part Class: Extended Part
U15 = ICM-40608: Supplier: LCSC; Supplier Part: C2833762; Manufacturer: TDK InvenSense(应美盛); Contributor: LCSC; JLCPCB Part Class: Extended Part
U22 = MPU6050-YJLTY: Supplier: LCSC; Supplier Part: C2912107; Manufacturer: null; JLCPCB Part Class: Extended Part; Contributor: LCSC
U27 = 1.14TFT-ST7789-SMT: Contributor: yanwudi
USB1 USB2 = MINI 5PTP-GZ: Supplier: LCSC; Supplier Part: C2681589; Manufacturer: SHOU HAN(首韩); Contributor: LCSC; JLCPCB Part Class: Extended Part
VS1 = VS1738: Contributor: shenruicn
BUZZER1 = HNB09A12: Supplier: LCSC; Supplier Part: C122600; Manufacturer: Jiangsu Huaneng Elec; Contributor: LCSC; JLCPCB Part Class: Extended Part
J1 = HDR-M-2.54_1x5: Supplier Part: C358687; Supplier: LCSC; Contributor: LCEDA_Lib
LED1 LED10 = XL-1615RGBC-RF: Supplier: LCSC; Supplier Part: C965840; Manufacturer: XINGLIGHT(成兴光); JLCPCB Part Class: Extended Part; Contributor: LCSC
LED2-LED9 POWER1 = LED-0603_R: Manufacturer: EVERLIGHT(台湾亿光); Manufacturer Part: 19-217/R6C-AL1M2VY/3T; Supplier Part: C72044; Supplier: LCSC; Contributor: LCEDA_01
Q1-Q4 = 2N3904(SOT-23): Supplier: LCSC; Manufacturer: KEC; Manufacturer Part: 2n3904S-RTK/PS; Supplier Part: C18536; Paste Type: SOT-23; Contributor: LCEDA_Lib
R5 = 74HC138B: Supplier: LCSC; Supplier Part: C2906780; Manufacturer: FM富满; Contributor: LCSC; JLCPCB Part Class: Extended Part
RN1-RN6 = RCML08W330FT: Supplier: LCSC; Supplier Part: C304660; Manufacturer: Guangdong Fenghua Advanced Tech; Contributor: LCSC; JLCPCB Part Class: Extended Part
U1 = ULN2003ADRG4: Supplier: LCSC; Supplier Part: C180142; Manufacturer: null; JLCPCB Part Class: Extended Part; Contributor: LCSC
U3 = 74AHC244PW: Supplier: LCSC; Manufacturer: PHILIPS; Supplier Part: C5515; JLCPCB Part Class: Extended Part
U16 U25 = 2041AS: Contributor: my8468
U26 = 74HC595S16-13: Supplier: LCSC; Manufacturer: DIODES(美台); Supplier Part: C129565; JLCPCB Part Class: Extended Part
CARD1 = TF-02A_C2889261: Supplier: LCSC; Supplier Part: C2889261; Manufacturer: Yuandi(台湾元迪); Manufacturer Part: TF-02A; Contributor: LCSC; JLCPCB Part Class: Extended Part
U12 = W25Q64FVSSIG: Supplier: LCSC; Manufacturer: WINBOND; Supplier Part: C14067; JLCPCB Part Class: Extended Part
U18-U21 = AT24C02N-10SU-2.7: Supplier: LCSC; Supplier Part: C2929937; Manufacturer: null; Contributor: LCSC; JLCPCB Part Class: Extended Part
U24 = IS61WV6416DBLL-10TLI-TR: Supplier: LCSC; Supplier Part: C2062666; Manufacturer: ISSI(美国芯成); Contributor: LCSC; JLCPCB Part Class: Extended Part
ADC IIC/UART SPI TIM = 2.54MM_2*6: Supplier: LCSC; Supplier Part: C9900020227; Manufacturer: null; JLCPCB Part Class: Extended Part; Contributor: lcsc
CAN J2 = HDR-M-2.54_1x4: Supplier Part: C124378; Supplier: LCSC; Contributor: LCEDA_Lib
J4 = HDR-M-2.54_2x5: Supplier Part: C178292; Supplier: LCSC; Contributor: LCEDA_Lib
SW4 = DSIC02LS-P: Supplier: LCSC; Supplier Part: C319042; Manufacturer: XKB Connectivity(中国星坤); Contributor: LCSC; JLCPCB Part Class: Extended Part
C2 C10 C13 C26 = C_Tan_SMD_A_US: Contributor: LCEDA_Lib
C11 = 10uF 16V 3*5: Supplier: LCSC; Manufacturer: ValuePro; Supplier Part: C43798; JLCPCB Part Class: Extended Part
CN1 = XT30PW-M: Supplier: LCSC; Supplier Part: C431092; Manufacturer: Changzhou Amass Elec; Contributor: LCSC; JLCPCB Part Class: Extended Part
SW3 SW8 = MSS22D18G2 125: Supplier: LCSC; Supplier Part: C2906278; Manufacturer: SHOU HAN(首韩); Contributor: LCSC
U2 U9 = AMS1117-3.3: sourceId: dwIGgezVh; Supplier: LCSC; Manufacturer: AMS; Supplier Part: C6186; JLCPCB Part Class: Basic Part
U5 = PMOS2031: Supplier: LCSC; Supplier Part: C9900021948; Manufacturer: null; JLCPCB Part Class: Extended Part; Contributor: lcsc
U7 = PL2303GL: Supplier: LCSC; Supplier Part: C2905408; Manufacturer: PROLIFIC(旺玖); Contributor: LCSC; JLCPCB Part Class: Extended Part
U11 = CR1220-A: Supplier: LCSC; Supplier Part: C9900016718; Manufacturer: null; Contributor: lcsc; JLCPCB Part Class: Extended Part

## Nets
3v3: ADC.11 C3.1 C4.2 C5.1 C15.1 C16.2 C17.2 C19.2 C20.2 C22.1 C23.1 C24.1 C28.1 C30.2 C31.2 C34.2 C35.2 C36.2 C37.2 C38.2 C39.1 C40.1 C41.1 C42.1 C43.1 C44.1 C45.1 C52.1 C53.2 C54.1 C55.2 C56.2 C57.1 C58.1 C59.2 C60.2 C61.2 C62.1 CARD1.4(VDD) D1.2(K) FPC1.17 FPC1.18 FPC2.1 FUSE.2 IIC/UART.11 J2.1 J4.1 J5.2 Q5.2(E) R3.1 R4.1 R5.6(E3) R5.16(VCC) R10.2 R16.1 R17.1 R29.2 RN5.5 RN5.6 RN5.7 RN5.8 RN6.1 RN6.2 RN6.3 RN6.4 SPI.5 SPI.11 TIM.5 TIM.11 U4.1 U6.8(VDD+) U8.3(VDD) U10.5(Vcc/AVcc) U10.6(ADC_VRef+) U12.3(WP#(IO2)) U12.7(HOLD#(IO3)) U12.8(VCC) U14.1(VCC2) U15.5(VDDIO) U15.8(VDD) U17.17(VDD_5) U17.32(VREF+) U17.33(VDDA) U17.39(VDD_4) U17.52(VDD_6) U17.62(VDD_7) U17.72(VDD_1) U17.84(VDD_8) U17.95(VDD_9) U17.108(VDD_2) U17.121(VDD_10) U17.131(VDD_11) U17.144(VDD_3) U18.8(VCC) U19.1(A0) U19.8(VCC) U20.2(A1) U20.8(VCC) U21.1(A0) U21.2(A1) U21.8(VCC) U22.8(VLOGIC) U22.13(VDD) U24.11(VDD) U24.33(VDD) U26.10(MR#) U26.16(VCC) U27.1(LEDA) U27.7(VDD) VS1.3(VCC)
5V_USB: C11.1 SW8.6 U7.7(VIN) USB1.1(VCC) USB2.1(VCC)
+5V: C47.1 CAN.1 J3.2
GND: ADC.4 ADC.10 C1.2 C2.2 C3.2 C4.1 C5.2 C6.1 C7.1 C8.1 C9.1 C10.2 C11.2 C12.2 C13.2 C14.2 C15.2 C16.1 C17.1 C18.1 C19.1 C20.1 C21.2 C22.2 C23.2 C24.2 C25.2 C26.2 C27.1 C28.2 C29.2 C30.1 C31.1 C32.1 C33.1 C34.1 C35.1 C36.1 C37.1 C38.1 C39.2 C40.2 C41.2 C42.2 C43.2 C44.2 C45.2 C46.1 C47.2 C48.1 C49.1 C50.1 C51.1 C52.2 C53.1 C54.2 C55.1 C56.1 C57.2 C58.2 C59.1 C60.1 C61.1 C62.2 CAN.2 CARD1.6(VSS) CARD1.10(GND) CARD1.11(GND) CARD1.12(GND) CARD1.13(GND) CN1.1 FPC1.2 FPC1.7 FPC1.16 FPC2.10 IIC/UART.10 J2.2 J3.1 J4.3 J4.5 J5.1 LED2.2 LED3.2 LED4.2 LED5.2 LED6.2 LED7.2 LED8.2 LED9.2 POWER1.2 Q1.1(E) Q2.1(E) Q3.1(E) Q4.1(E) R5.5(E2#) R5.8(GND) R7.1 SPI.4 SPI.10 SW1.1 SW2.1 SW4.3 SW4.4 SW5.1 SW6.1 SW7.1 SW8.1 TIM.4 TIM.10 U1.8(E) U2.1(GND/ADJ) U3.10(GND) U4.3 U6.4(VDD-/GND) U7.1(GND) U8.1(GND) U9.1(GND/ADJ) U10.7(Gnd/AGnd) U10.21(EP) U11.2 U12.4(GND) U14.4(GND) U15.6(GND) U15.7(RESV) U17.16(VSS_5) U17.30(VSSA) U17.31(VREF-) U17.38(VSS_4) U17.51(VSS_6) U17.61(VSS_7) U17.71(VSS_1) U17.83(VSS_8) U17.94(VSS_9) U17.107(VSS_2) U17.120(VSS_10) U17.130(VSS_11) U17.143(VSS_3) U18.1(A0) U18.2(A1) U18.3(A2) U18.4(GND) U18.7(WP) U19.2(A1) U19.3(A2) U19.4(GND) U19.7(WP) U20.1(A0) U20.3(A2) U20.4(GND) U20.7(WP) U21.3(A2) U21.4(GND) U21.7(WP) U22.1(CLKIN) U22.11(FSYNC) U22.18(GND) U22.25(EP) U24.12(GND) U24.34(GND) U26.8(GND) U26.13(OE#) U27.2(GND) USB1.4(ID) USB1.5(GND) USB2.5(GND) VS1.2(GND)
VCC: ADC.5 BUZZER1.1(+) C10.1 C26.1 C27.2 J1.1 LED1.3(COM+) LED10.3(COM+) R2.2 SW8.5 U1.9(VCOM) U2.4(Vout) U3.20(VCC) U9.3(Vin)
8LED_OE#: R16.2 R20.2 U3.1(1OE#) U3.19(2OE#)
595dat: U17.90(PG5) U24.1(A15) U26.14(DS)
595latch: U17.50(PF12) U24.24(A6) U26.12(STCP)
595shift: U17.53(PF13) U24.21(A7) U26.11(SHCP)
2303rx: SW3.5 U7.4(RXD)
2303tx: SW3.2 U7.2(TXD)
__rgb_b: R9.1 U1.10(7C)
__rgb_g: R8.1 U1.11(6C)
__smg1: R5.15(Y0#) U16.12(S1)
__smg2: R5.14(Y1#) U16.9(S2)
__smg3: R5.13(Y2#) U16.8(S3)
__smg4: R5.12(Y3#) U16.6(S4)
__smg5: R5.11(Y4#) U25.12(S1)
__smg6: R5.10(Y5#) U25.9(S2)
__smg7: R5.9(Y6#) U25.8(S3)
__smg8: R5.7(Y7#) U25.6(S4)
__smgA: U16.11(A) U25.11(A) U26.15(Q0)
__smgB: U16.7(B) U25.7(B) U26.1(Q1)
__smgC: U16.4(C) U25.4(C) U26.2(Q2)
__smgD: U16.2(D) U25.2(D) U26.3(Q3)
__smgDot: U16.3(DP) U25.3(DP) U26.7(Q7)
__smgE: U16.1(E) U25.1(E) U26.4(Q4)
__smgF: U16.10(F) U25.10(F) U26.5(Q5)
__smgG: U16.5(G) U25.5(G) U26.6(Q6)
a1: J3.3 TIM.7 U17.60(PE9) U24.15(IO6)
A11: U17.103(PA11) USB2.2(D-)
A12: R14.2 U17.104(PA12) USB2.3(D+)
adc_bat: U6.6(2IN-) U6.7(2OUT) U10.14(P3.6/ADC14/INT2/RxD_2/CMP-)
adc_board: U6.1(1OUT) U6.2(1IN-) U17.26(PC0)
b1: J3.4 TIM.9 U17.64(PE11) U24.29(IO8)
bat: CN1.2 R15.2 SW8.3 U5.3(S)
bat_switch: R15.1 SW8.2 U5.1(G)
beep: U1.5(5B) U17.97(PC7)
BOOT0: RN5.1 SW4.1 U17.138(BOOT0)
BOOT1: RN5.2 SW4.2 U17.48(PB2)
button_battery: D1.1(K) U6.5(2IN+) U11.1 U14.8(VCC1)
camera_data0: FPC1.8 FPC2.2 TIM.1 U17.34(PA0-WKUP)
camera_data1: FPC1.9 FPC2.3 TIM.3 U17.35(PA1)
camera_data2: FPC1.10 FPC2.4 TIM.2 U17.36(PA2)
camera_data3: FPC1.11 FPC2.5 TIM.6 U17.37(PA3)
camera_data4: FPC1.12 FPC2.6 U17.40(PA4)
camera_data5: FPC1.13 FPC2.7 SPI.7 U17.41(PA5)
camera_data6: FPC1.14 FPC2.8 SPI.8 U17.42(PA6)
camera_data7: FPC1.15 FPC2.9 SPI.9 U17.43(PA7)
camera_rx: FPC1.4 FPC2.13 IIC/UART.3 U3.6(1A2) U17.69(PB10)
camera_tx: FPC1.3 FPC2.14 IIC/UART.4 U3.8(1A3) U17.70(PB11)
can_Rx: CAN.3 U17.114(PD0)
can_Tx: CAN.4 U17.115(PD1)
D6: IIC/UART.5 R11.1 U17.122(PD6)
ds18b20: R4.2 R19.2 U8.2(DQ)
ds1302_ce: U10.12(P3.4/ADC12/T0/T1CLKO/MOSI_4/PWM4P_2/PWM8_2/CMPO) U14.5(CE)
ds1302_io: U10.13(P3.5/ADC13/T1/T0CLKO/SS_4/PWMFLT/PWMFLT2) U14.6(I/O)
ds1302_sclk: U10.15(P3.7/INT3/TxD_2/CMP+) U14.7(SCLK)
f103NRST: C46.2 J4.10 RN5.3 SW7.2 U17.25(NRST)
flash_CS: R29.1 U12.1(CS#) U17.126(PG11)
fsmc_add0: U17.10(PF0) U24.44(A0)
fsmc_add1: U17.11(PF1) U24.43(A1)
fsmc_add2: U17.12(PF2) U24.42(A2)
fsmc_add3: U17.13(PF3) U24.27(A3)
fsmc_add4: U17.14(PF4) U24.26(A4)
fsmc_add5: U17.15(PF5) U24.25(A5)
fsmc_add8: R18.1 U17.54(PF14) U24.20(A8)
fsmc_add9: R19.1 U17.55(PF15) U24.19(A9)
fsmc_add10: R20.1 U17.56(PG0) U24.18(A10)
fsmc_add11: R21.1 U17.57(PG1) U24.5(A11)
fsmc_add12: R5.2(A1) U17.87(PG2) U24.4(A12)
fsmc_add13: R5.1(A0) U17.88(PG3) U24.3(A13)
fsmc_add14: R5.3(A2) U17.89(PG4) U24.2(A14)
fsmc_dat0: U17.85(PD14) U24.7(IO0)
fsmc_dat1: U17.86(PD15) U24.8(IO1)
fsmc_dat2: RN8.1 U24.9(IO2)
fsmc_dat3: RN8.2 U24.10(IO3)
fsmc_dat4: U17.58(PE7) U24.13(IO4)
fsmc_dat5: U17.59(PE8) U24.14(IO5)
fsmc_dat7: U17.63(PE10) U24.16(IO7)
fsmc_dat9: U17.65(PE12) U24.30(IO9)
fsmc_dat10: TIM.8 U17.66(PE13) U24.31(IO10)
fsmc_dat11: TIM.12 U17.67(PE14) U24.32(IO11)
fsmc_dat12: U17.68(PE15) U24.35(IO12)
fsmc_dat13: U17.77(PD8) U24.36(IO13)
fsmc_dat14: U17.78(PD9) U24.37(IO14)
fsmc_dat15: U17.79(PD10) U24.38(IO15)
fsmc_NBL0: U17.141(PE0) U24.39(LB#)
fsmc_NBL1: U17.142(PE1) U24.40(UB#)
fsmc_NE1: R17.2 U17.123(PD7) U24.6(CE#)
fsmc_NOE: U17.118(PD4) U24.41(OE#)
fsmc_NWE: IIC/UART.6 U17.119(PD5) U24.17(WE#)
hc138E#: R5.4(E1#) R10.1 R21.2
href: FPC1.5 U17.91(PG6)
icm_cs: U15.12(AP_CS) U17.125(PG10)
icm_int1: U15.4(INT1/INT) U17.44(PC4)
icm_int2: U15.9(INT2) U17.45(PC5)
key1: C7.2 SW2.2 U17.7(PC13-TAMPER-RTC)
key2: C6.2 SW1.2 U17.110(PA15)
key3: C8.2 SW5.2 U17.80(PD11)
key4: C9.2 SW6.2 U17.100(PA8)
leds0: FPC2.11 IIC/UART.12 U3.2(1A0) U17.139(PB8)
leds1: FPC2.12 IIC/UART.9 U3.4(1A1) U17.140(PB9)
leds4: FPC2.15 U3.17(2A0) U17.73(PB12)
leds5: FPC2.16 U3.15(2A1) U17.74(PB13)
leds6: FPC2.17 SPI.6 U3.13(2A2) U17.75(PB14)
leds7: FPC2.18 SPI.12 U3.11(2A3) U17.76(PB15)
miso: SPI.2 U10.11(P3.3/ADC11/INT1/MISO_4/I2CSDA_4/PWM4N_2/PWM7_2) U12.2(DO(IO1)) U15.1(AP_SDO/AP_AD0) U17.134(PB4)
mosi: J5.4 SPI.3 U10.18(PWM2N/T2CLKO/MOSI/P1.3) U12.5(DI(IO0)) U15.14(AP_SDA/AP_SDIO/AP_SD) U17.135(PB5) U27.5(SDA)
mpu6050int: U17.117(PD3) U22.12(INT)
oled_cs: J5.7 U17.128(PG13)
oled_dc: J5.6 U17.129(PG14)
oled_rst: J5.5 U17.132(PG15)
osc32_in: C50.2 U17.8(PC14-OSC32_IN) U23.1
osc32_out: C51.2 U17.9(PC15-OSC32_OUT) U23.2
osc_in: C48.2 R6.1 RN7.1 X1.1(OSC1)
OSC_in/FSMC_D2: RN7.4 RN8.4 U17.23(OSC_IN)
osc_out: C49.2 R6.2 RN7.2 X1.2(OSC2)
OSC_out/FSMC_D3: RN7.3 RN8.3 U17.24(OSC_OUT)
pclk: FPC1.1 U17.81(PD12)
rgb_b_stc8: U1.7(7B) U10.4(MCLKO/RST/PWM6_2/P5.4)
rgb_b_stm32: RN3.7 U17.96(PC6)
rgb_g_stc8: U1.6(6B) U10.3(XTALI/TxD_3/PWM5_2/PWM4N/P1.7)
rgb_g_stm32: RN3.6 U17.47(PB1)
rgb_r_stc8: RN3.8 U10.2(XTALO/MCLKO_2/RxD_3/PWM4P/P1.6)
rgb_r_stm32: RN3.5 U17.46(PB0)
scl: IIC/UART.1 U10.1(I2CSCL/SCLK/PWM3N/P1.5) U17.136(PB6) U18.6(SCL) U19.6(SCL) U20.6(SCL) U21.6(SCL) U22.23(SCL)
sclk: J5.3 SPI.1 U10.10(P3.2/ADC10/INT0/SCLK_4/I2CSCL_4/PWMETI/PWMETI2) U12.6(CLK) U15.13(AP_SCL/AP_SCLK) U17.133(PB3) U27.6(SCL)
screenIO: J5.8 U17.82(PD13)
sd_dect: CARD1.9(CD) U17.92(PG7)
sda: IIC/UART.2 U10.17(PWM3P/SDA/MISO/P1.4) U17.137(PB7) U18.5(SDA) U19.5(SDA) U20.5(SDA) U21.5(SDA) U22.24(SDA)
sdio_ck: CARD1.5(CLK) U10.16(PWM1P/RxD2/ADC0/P1.0) U17.113(PC12)
sdio_cmd: CARD1.3(CMD) RN6.6 U10.20(PWM1N/TXD2/ADC1/P1.1) U17.116(PD2)
sdio_d0: CARD1.7(DAT0) RN6.5 U17.98(PC8)
sdio_d1: CARD1.8(DAT1) RN5.4 U17.99(PC9)
sdio_d2: CARD1.1(DAT2) R22.1 RN6.8 U17.111(PC10)
sdio_d3: CARD1.2(CD/DAT3) R23.1 RN6.7 U17.112(PC11)
stc8_2303_rx: SW3.4 U10.8(P3.0/ADC8/RxD/INT4)
stc8_2303_tx: SW3.1 U10.9(P3.1/ADC9/TxD)
stc8_cs: U10.19(PWM2P/T2/SS/P1.2) U17.49(PF11)
stepMotor_ch1: U1.1(1B) U17.2(PE3)
stepMotor_ch2: U1.2(2B) U17.3(PE4)
stepMotor_ch3: U1.3(3B) U17.4(PE5)
stepMotor_ch4: U1.4(4B) U17.5(PE6)
stm32_2303_rx: J4.9 SW3.6 U17.101(PA9)
stm32_2303_tx: J4.7 SW3.3 U17.102(PA10)
stm32RX_2: IIC/UART.7 R23.2
stm32TX_2: IIC/UART.8 R22.2
stmAdc1: ADC.1 U17.27(PC1)
stmAdc2: ADC.3 U17.28(PC2)
stmAdc3: ADC.2 U17.29(PC3)
stmAdc4: ADC.6 U17.18(PF6)
stmAdc5: ADC.7 U17.19(PF7)
stmAdc6: ADC.9 U17.20(PF8)
stmAdc7: ADC.8 U17.21(PF9)
stmAdc8: ADC.12 U17.22(PF10)
SWCLK: J2.4 J4.4 U17.109(PA14)
SWDIO: J2.3 J4.2 U17.105(PA13)
tft_cs: U17.124(PG9) U27.8(CS)
tft_dc: U17.127(PG12) U27.4(RS)
tft_rst: U17.93(PG8) U27.3(RESET)
vs1738: R3.2 R18.2 VS1.1(OUT)
vsync: FPC1.6 U17.1(PE2)
Net-(BUZZER1-2): BUZZER1.2(-) R1.2
Net-(C1-1): C1.1 U7.3(VDD_IO) U7.8(VO_33)
Net-(C2-1): C2.1 C25.1 FUSE.1 U9.2(Vout) U9.4(Vout)
Net-(C12-1): C12.1 C13.1 FUSE1.1 U2.3(Vin)
Net-(C14-1): C14.1 U2.2(Vout)
Net-(C18-2): C18.2 U13.1 U14.3(X2)
Net-(C21-1): C21.1 U13.2 U14.2(X1)
Net-(C29-1): C29.1 U22.20(CPOUT)
Net-(C32-2): C32.2 U22.10(REGOUT)
Net-(C33-2): C33.2 D1.3(A) U17.6(VBAT)
Net-(FUSE1-2): FUSE1.2 U5.2(D)
Net-(J1-2): J1.2 U1.16(1C)
Net-(J1-3): J1.3 U1.15(2C)
Net-(J1-4): J1.4 U1.14(3C)
Net-(J1-5): J1.5 U1.13(4C)
Net-(LED1-1): LED1.1(R-) RN4.5
Net-(LED1-2): LED1.2(G-) RN4.6
Net-(LED1-4): LED1.4(B-) RN4.7
Net-(LED2-1): LED2.1 RN1.1
Net-(LED3-1): LED3.1 RN1.2
Net-(LED4-1): LED4.1 RN1.3
Net-(LED5-1): LED5.1 RN1.4
Net-(LED6-1): LED6.1 RN2.8
Net-(LED7-1): LED7.1 RN2.7
Net-(LED8-1): LED8.1 RN2.6
Net-(LED9-1): LED9.1 RN2.5
Net-(LED10-1): LED10.1(R-) RN4.8
Net-(LED10-2): LED10.2(G-) R8.2
Net-(LED10-4): LED10.4(B-) R9.2
Net-(POWER1-1): POWER1.1 R2.1
Net-(Q1-2): Q1.2(B) RN3.4
Net-(Q1-3): Q1.3(C) RN4.4
Net-(Q2-2): Q2.2(B) RN3.3
Net-(Q2-3): Q2.3(C) RN4.3
Net-(Q3-2): Q3.2(B) RN3.2
Net-(Q3-3): Q3.3(C) RN4.2
Net-(Q4-2): Q4.2(B) RN3.1
Net-(Q4-3): Q4.3(C) RN4.1
Net-(Q5-1): Q5.1(B) R11.2
Net-(Q5-3): Q5.3(C) R14.1
Net-(R1-1): R1.1 U1.12(5C)
Net-(R7-2): R7.2 U22.9(AD0)
Net-(R12-1): R12.1 U7.6(DM)
Net-(R12-2): R12.2 USB1.2(D-)
Net-(R13-1): R13.1 U7.5(DP)
Net-(R13-2): R13.2 USB1.3(D+)
Net-(RN1-5): RN1.5 U3.9(2Y3)
Net-(RN1-6): RN1.6 U3.7(2Y2)
Net-(RN1-7): RN1.7 U3.5(2Y1)
Net-(RN1-8): RN1.8 U3.3(2Y0)
Net-(RN2-1): RN2.1 U3.18(1Y0)
Net-(RN2-2): RN2.2 U3.16(1Y1)
Net-(RN2-3): RN2.3 U3.14(1Y2)
Net-(RN2-4): RN2.4 U3.12(1Y3)
Net-(U4-2): U4.2 U6.3(1IN+)

Not connected (* = marked no-connect by the designer): CN1 3* 4*; FPC1 19* 20*; FPC2 19* 20*; J3 5* 6*; J4 6* 8*; SW8 4*; U15 2(RESV)* 3(RESV)* 10(RESV)* 11(RESV)*; U17 106(NC)*; U22 2(NC)* 3(NC)* 4(NC)* 5(NC)* 6(AUX_DA)* 7(AUX_CL)* 14(NC)* 15(NC)* 16(NC)* 17(NC)* 19(RESV)* 21(RESV)* 22(RESV)*; U24 22(NC)* 23(NC)* 28(NC)*; U26 9(Q7S)*; USB1 6(EH)*; USB2 4(ID)* 6(EH)*

## Notes on the sheets
sheet 2
- 电池5V
- 串口、USB供电与供电选择
- 3V3供电
- 纽扣电池
- 电源指示灯
- 串口信号选择
sheet 5
- RGB
- 8位并行LED
- 共阴极数码管
- 蜂鸣器与五线四相步进电机
sheet 6
- w25q
- sd卡
- SRAM
- AT24C02阵列
sheet 7
- BOOT配置
- SWD烧录
- 逐飞SWD
- 复位
